# EasyEDA Pro project ProPrj_esp32s31-mp4_2026-09-21.epro, schematic Schematic1

## Sheets
1 MCU: Assembly Variant: Basic; Board Name: Board1; Create Date: 2026-09-02; Page Name: P1; Project Name: esp32s31-mp4; Schematic Name: Schematic1; Update Date: 2026-09-02; Company: 嘉立创EDA; Page Size: A4; Version: V1.0
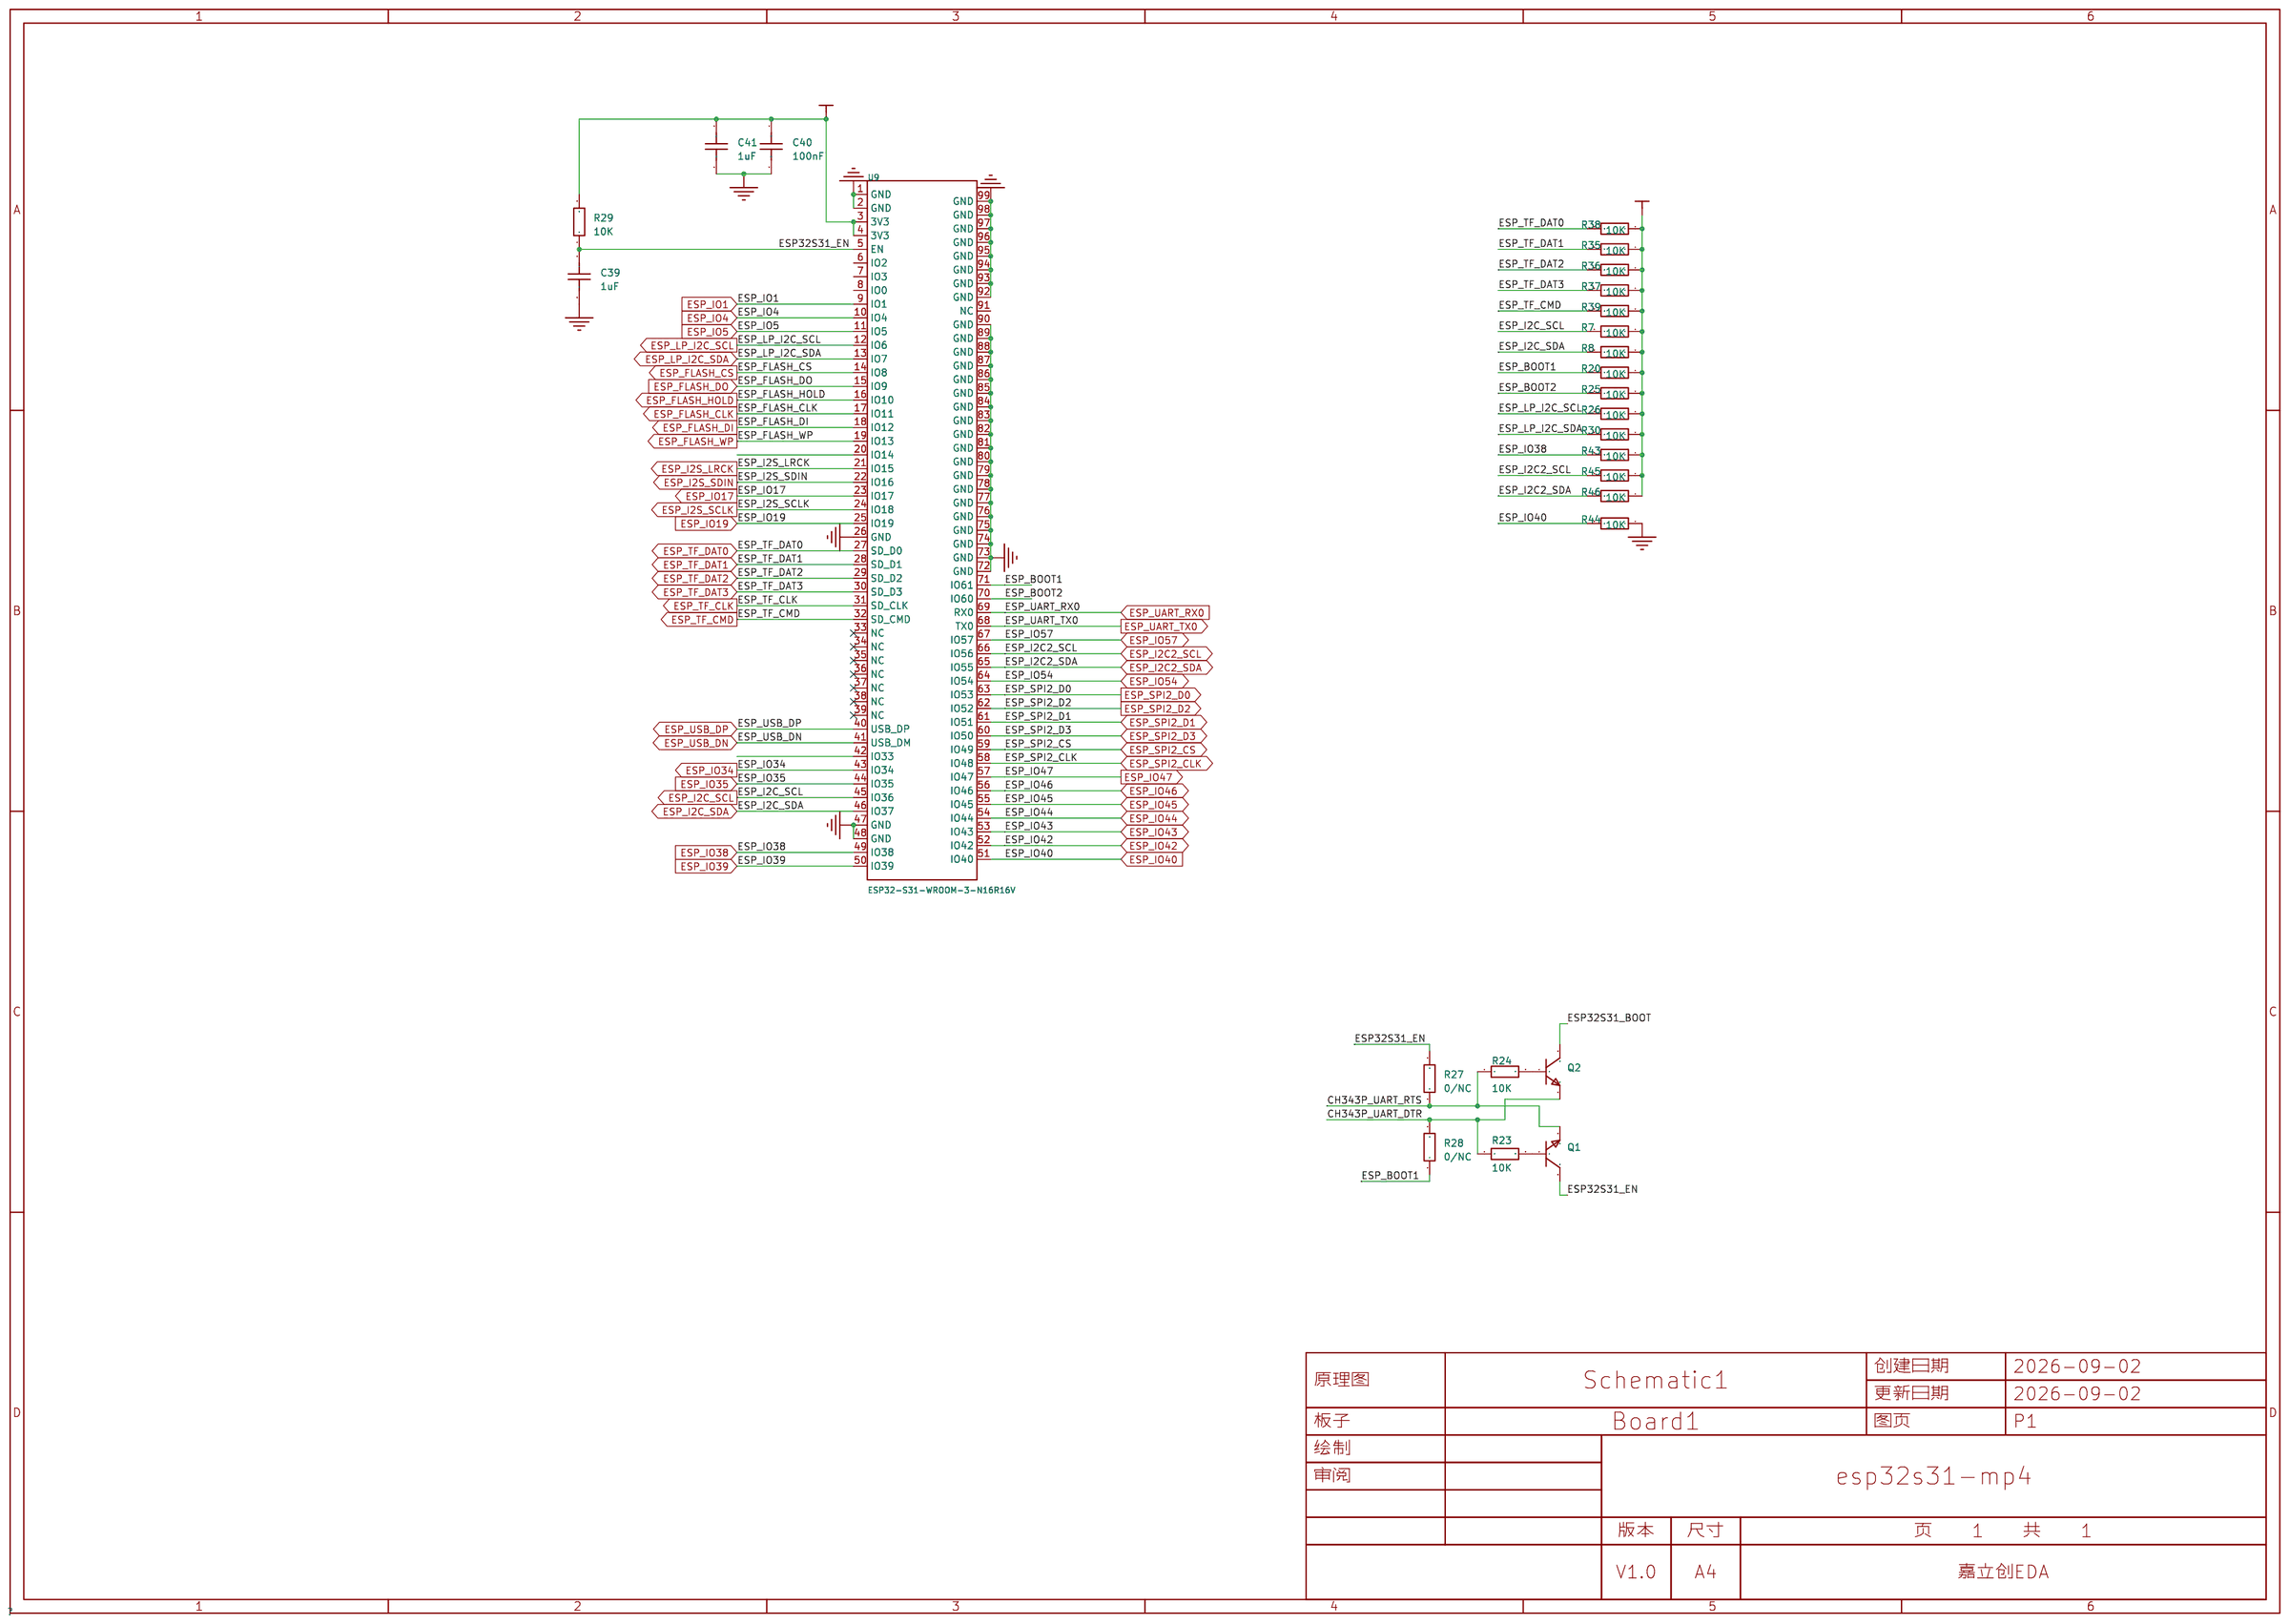
[diagram p0: MCU]
2 POWER: Create Date: 2026-09-14; Page Name: P2; Update Date: 2026-09-14
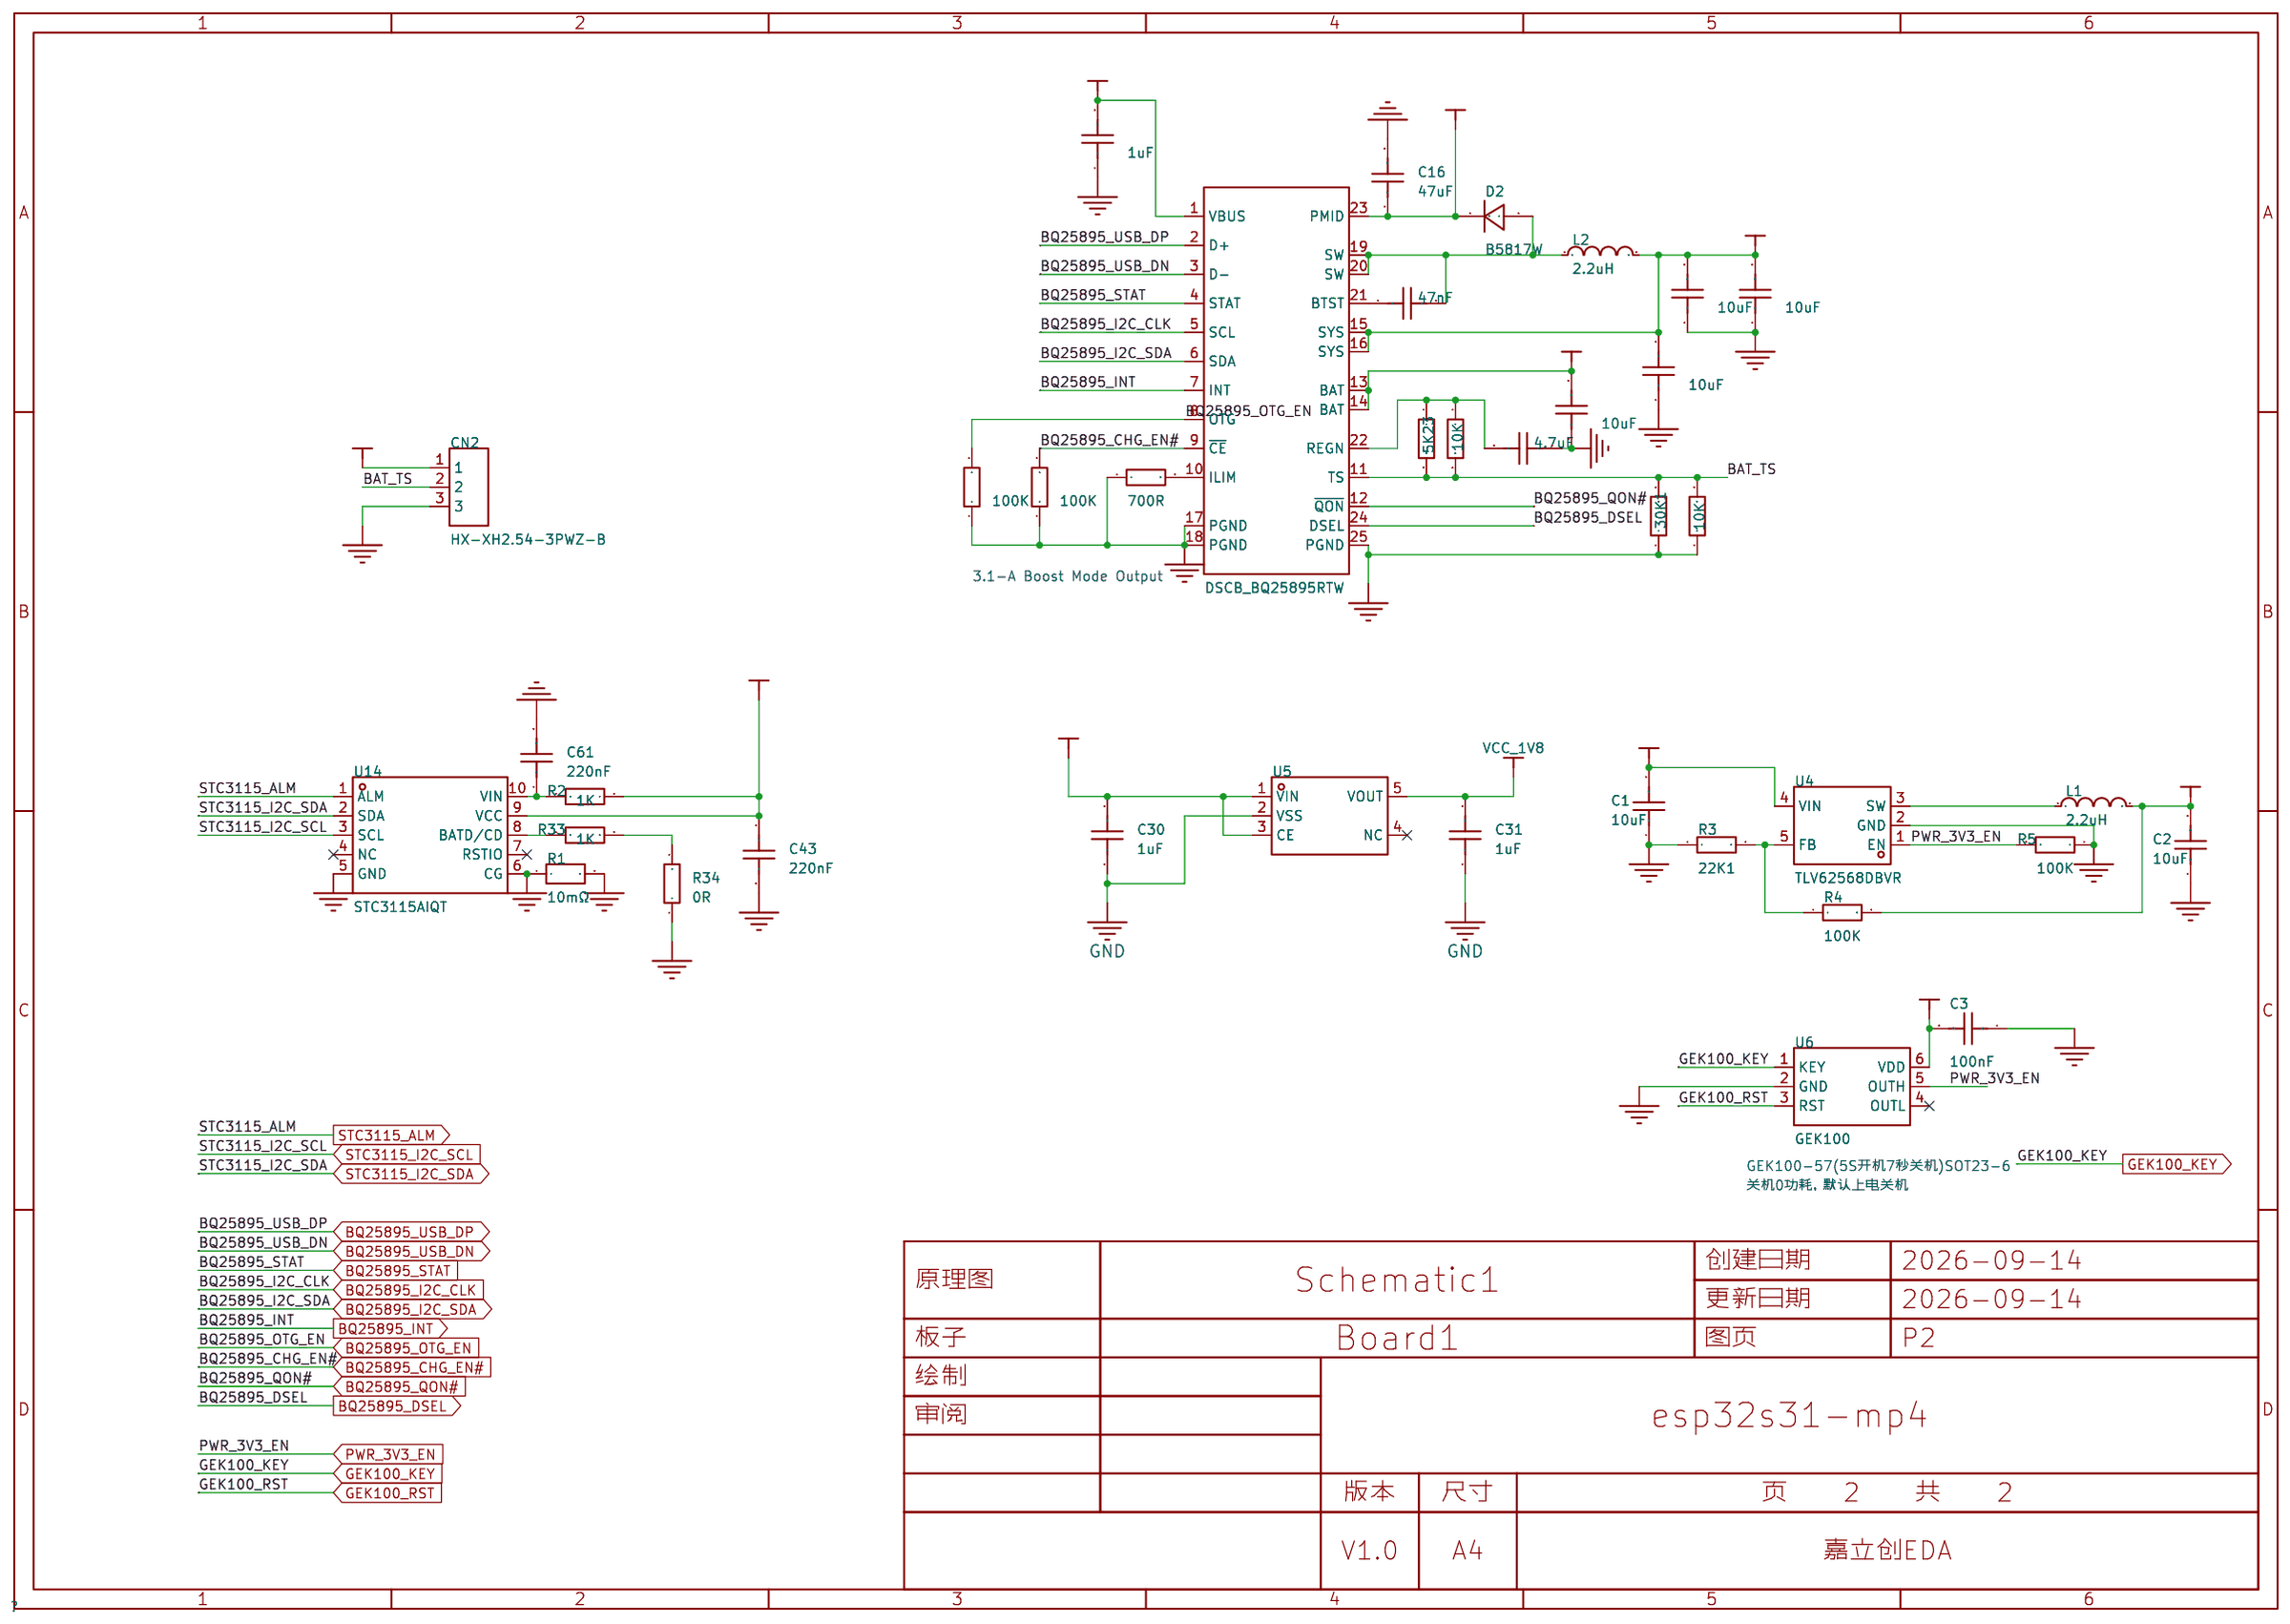
[diagram p1: POWER]
3 DAC: Create Date: 2026-09-14; Update Date: 2026-09-14
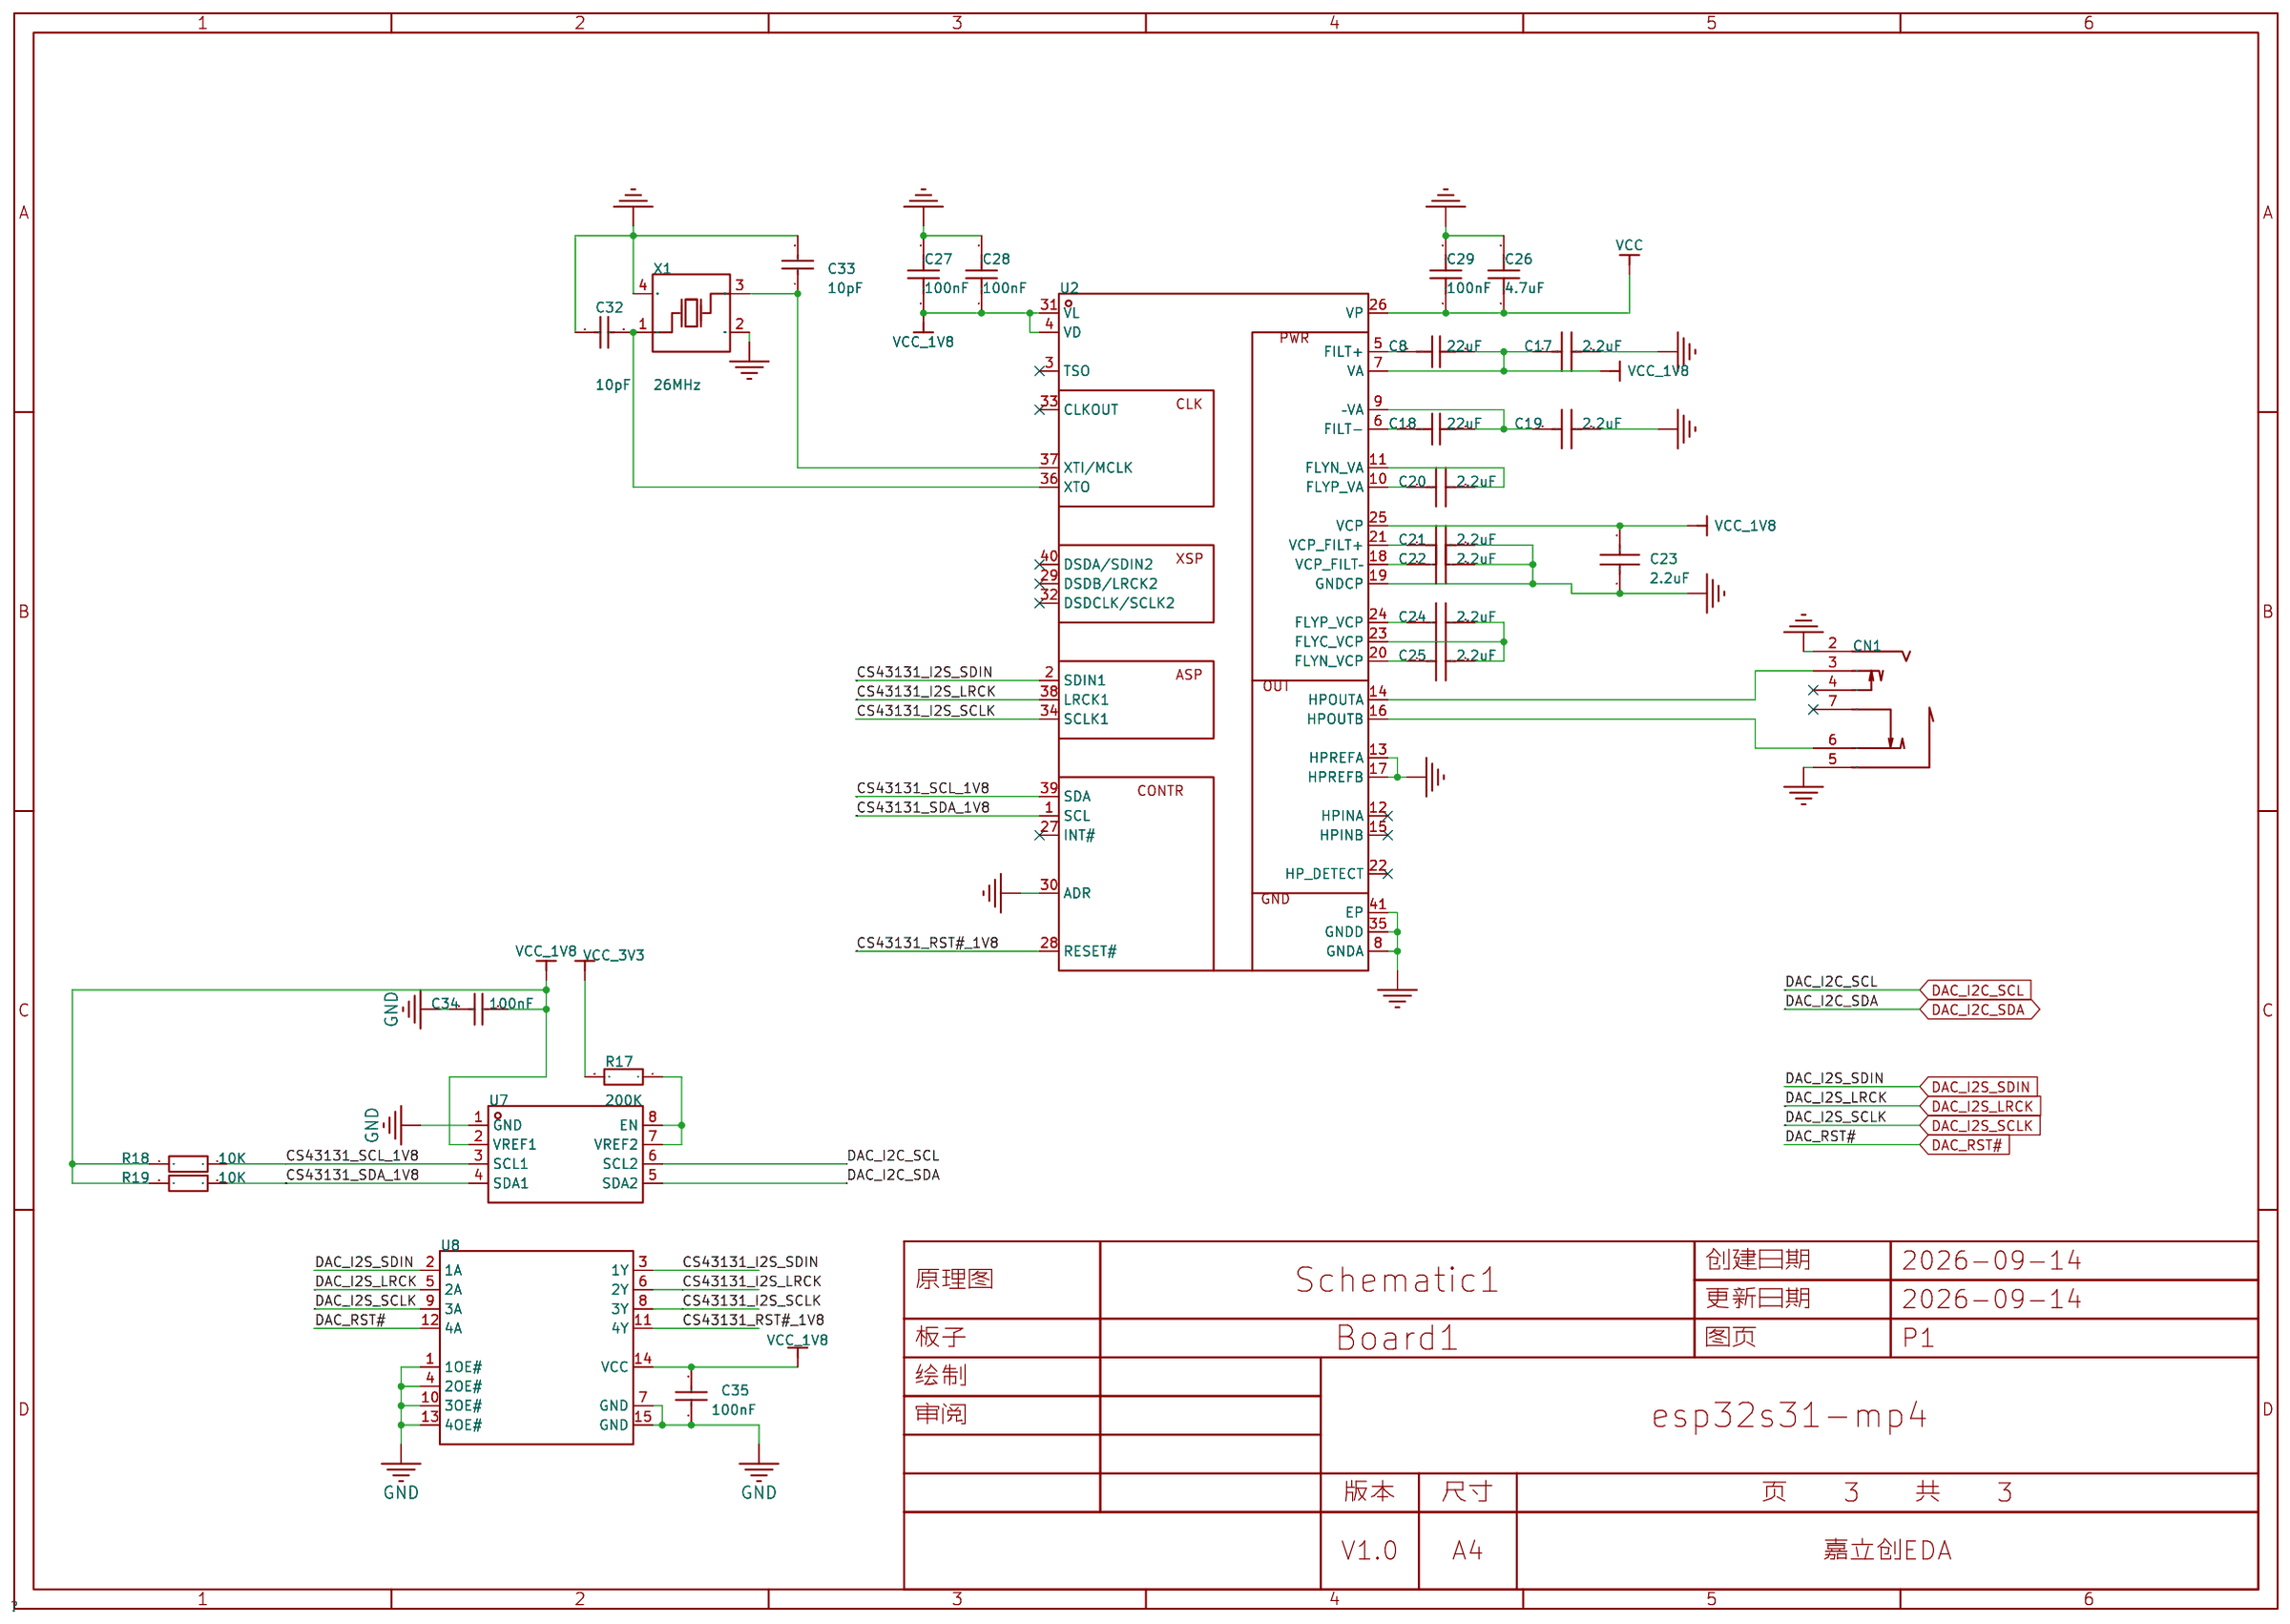
[diagram p2: DAC]
4 DISPLAY: Create Date: 2026-09-14; Update Date: 2026-09-14
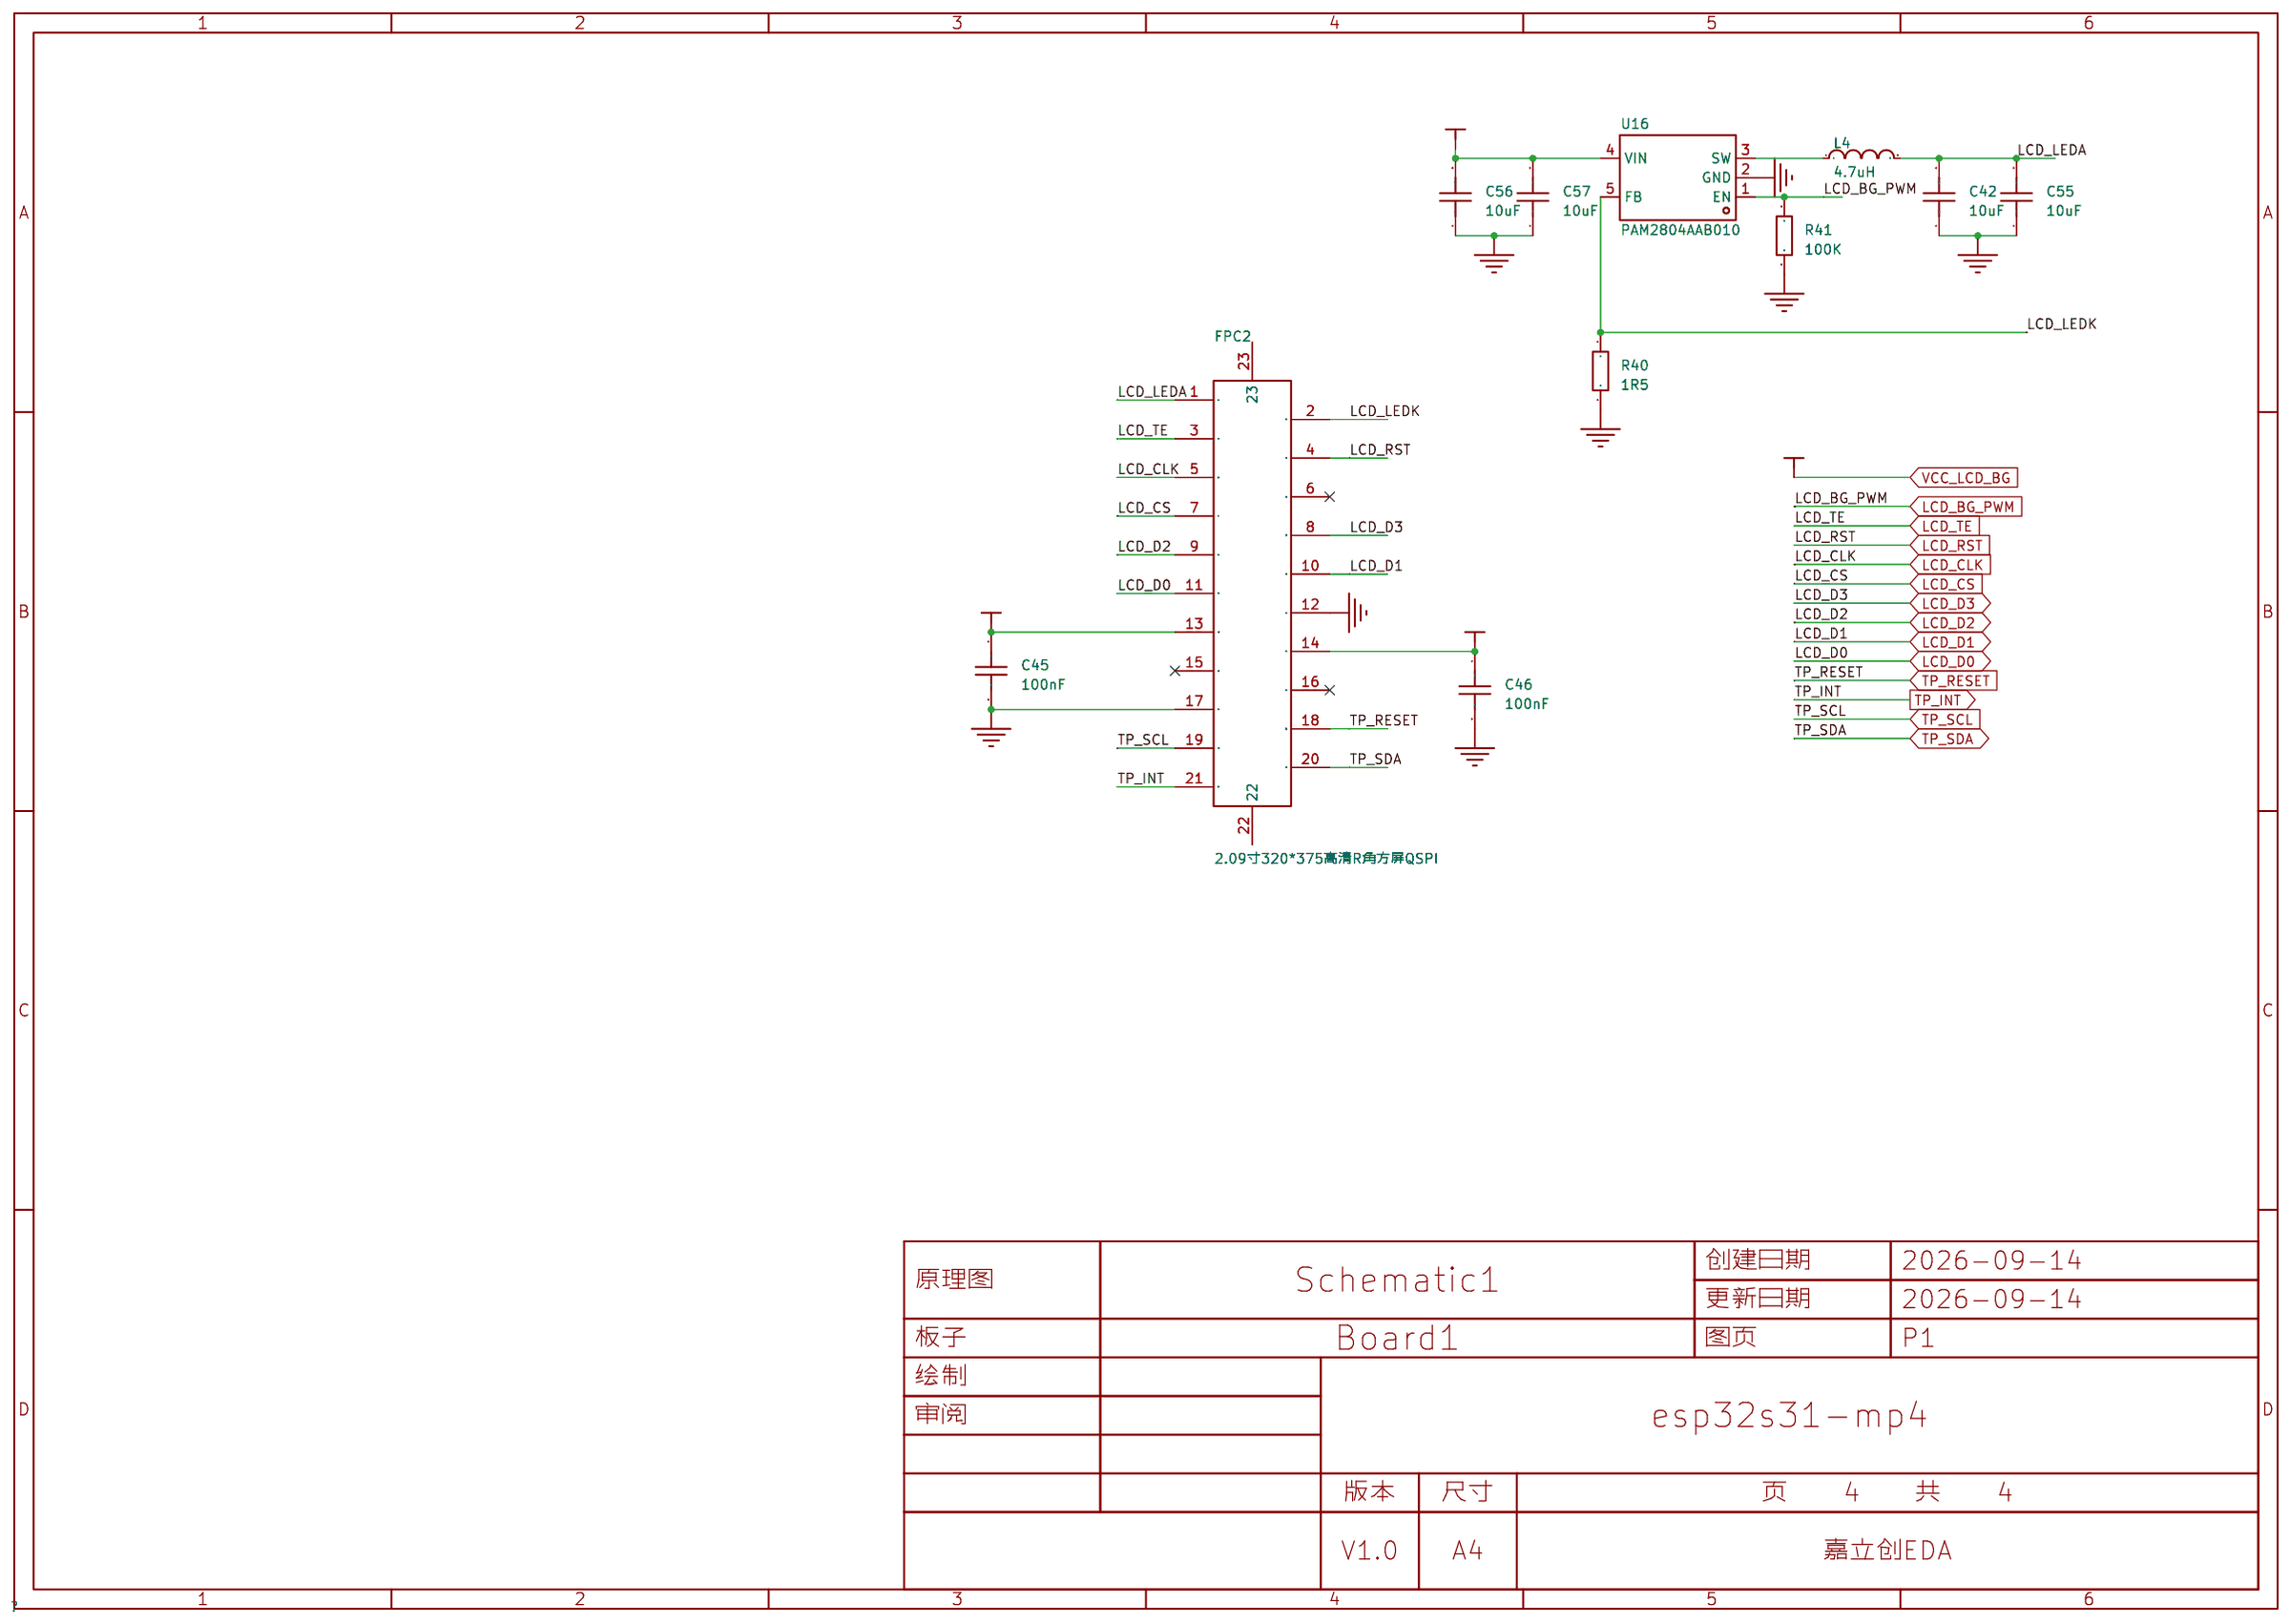
[diagram p3: DISPLAY]
5 MOTOR: Create Date: 2026-09-16; Update Date: 2026-09-16
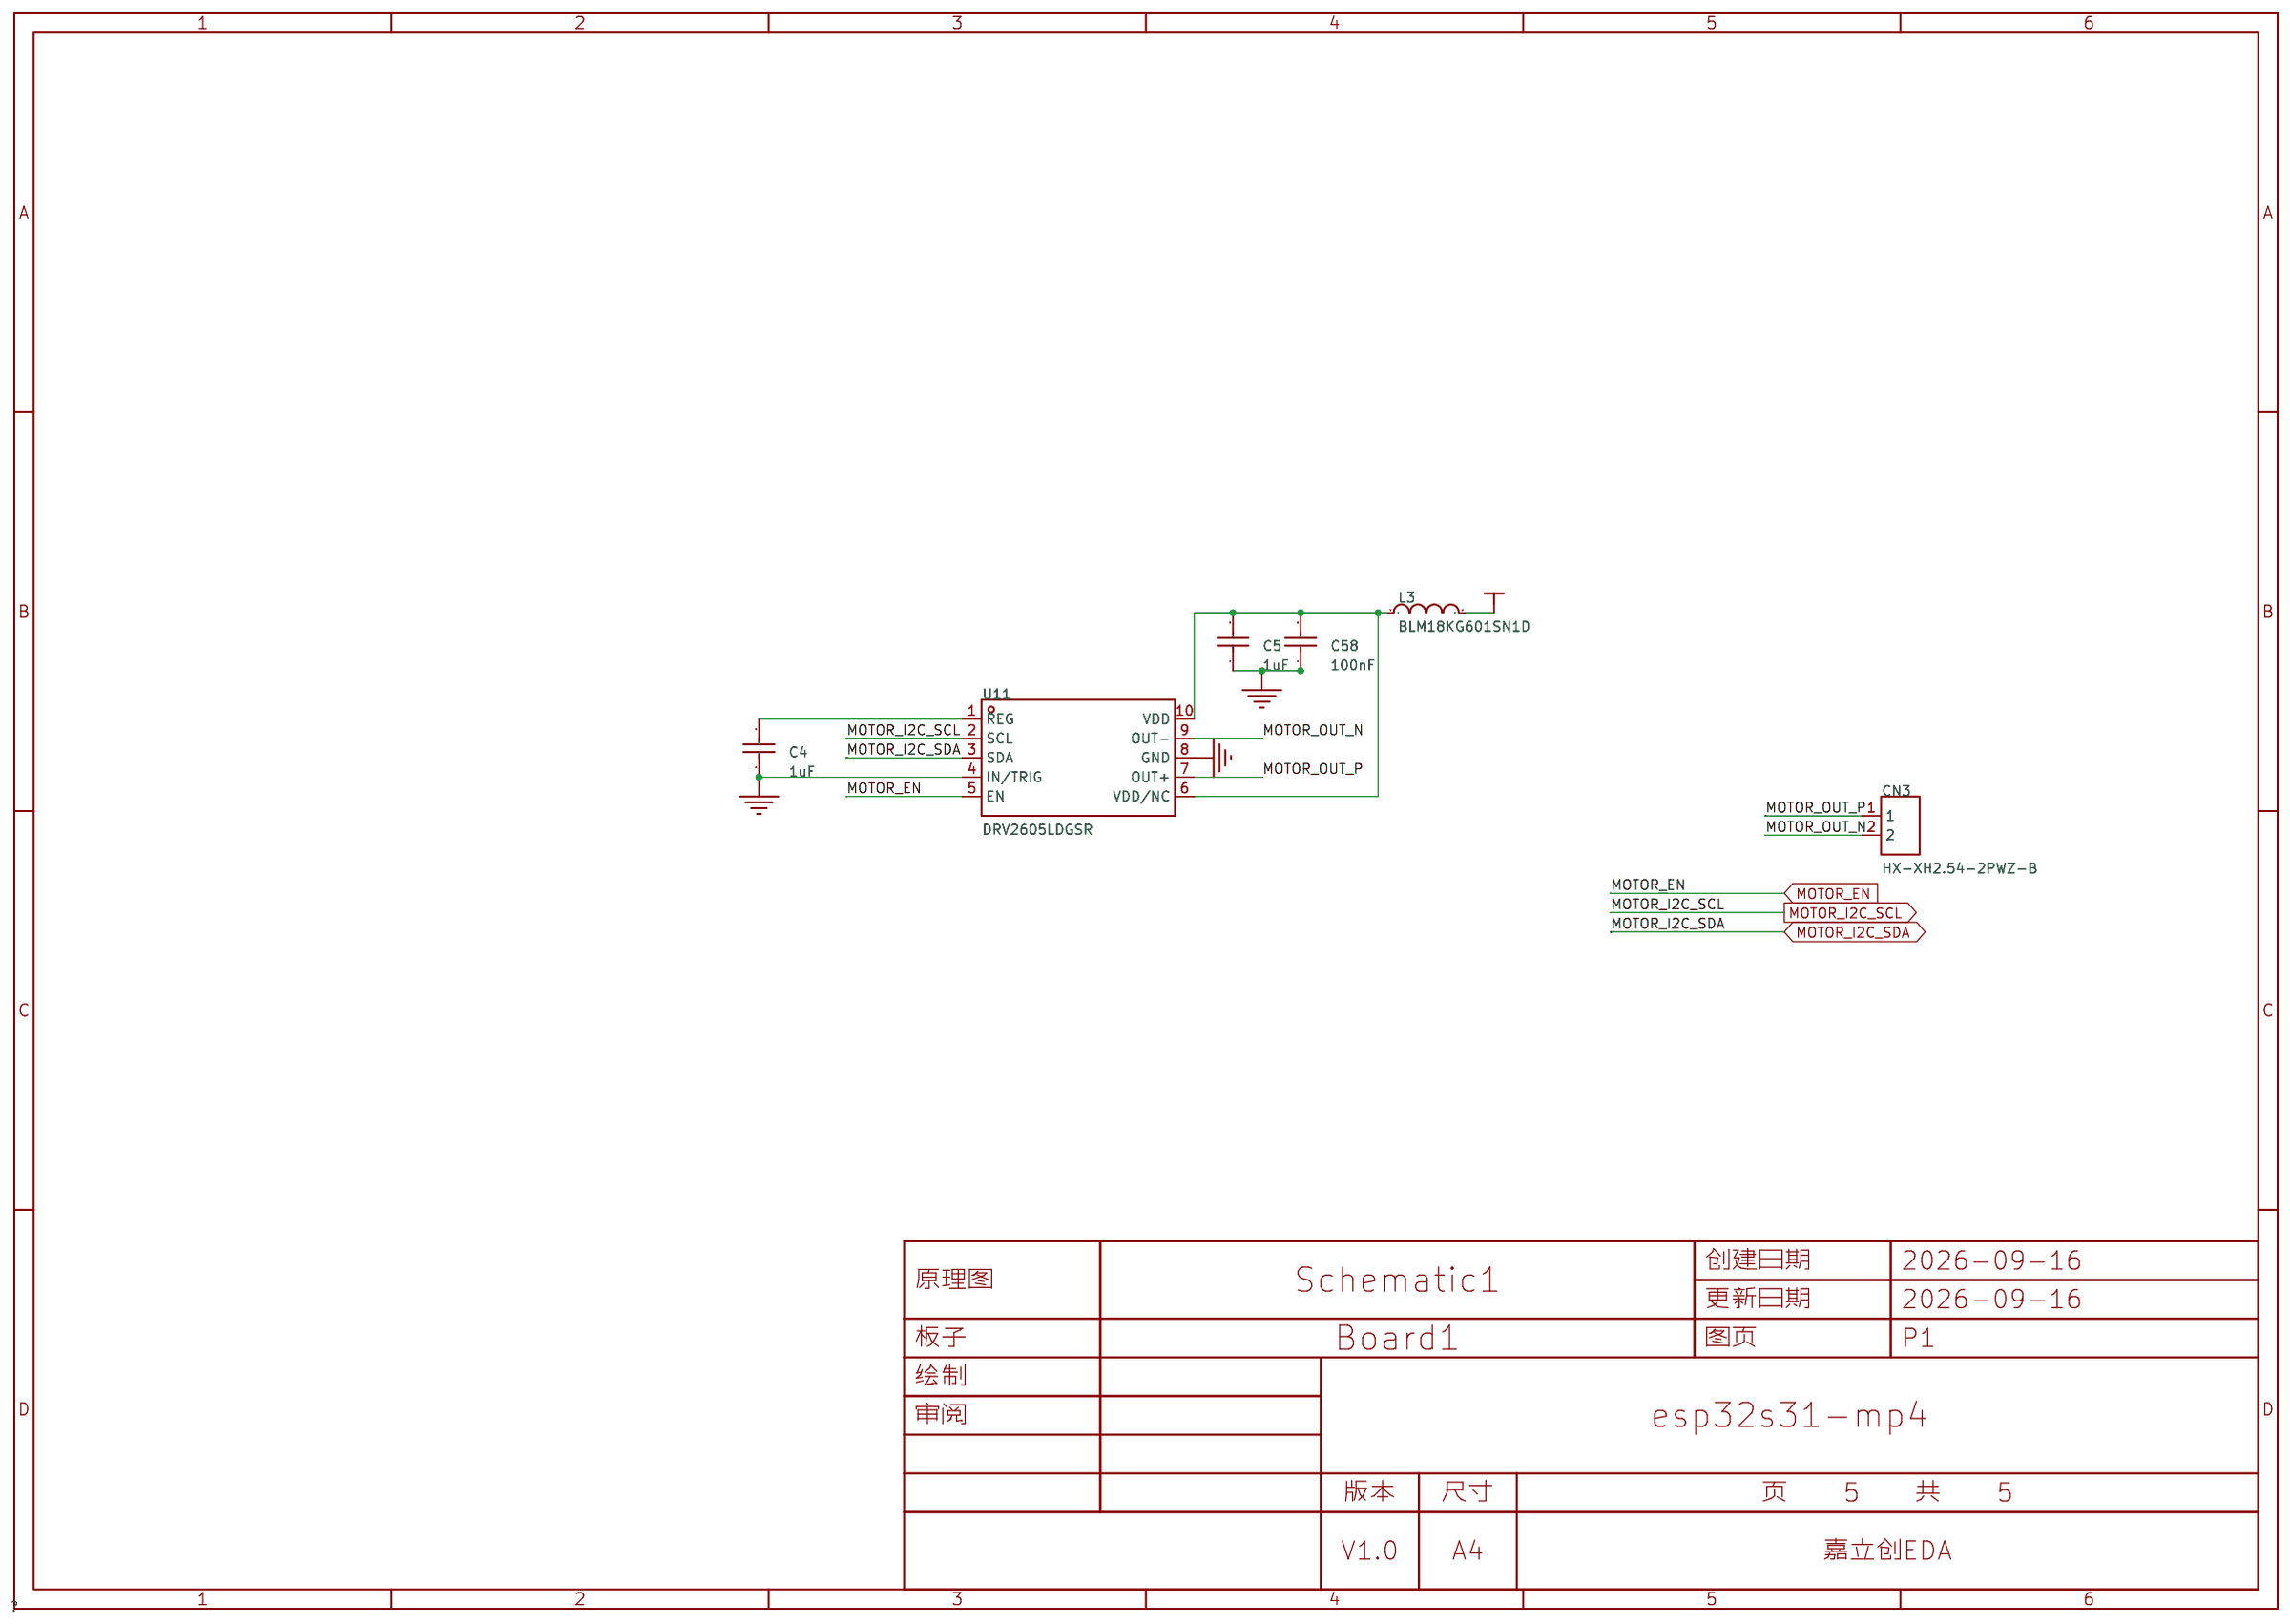
[diagram p4: MOTOR]
6 USB: Create Date: 2026-09-16; Update Date: 2026-09-16
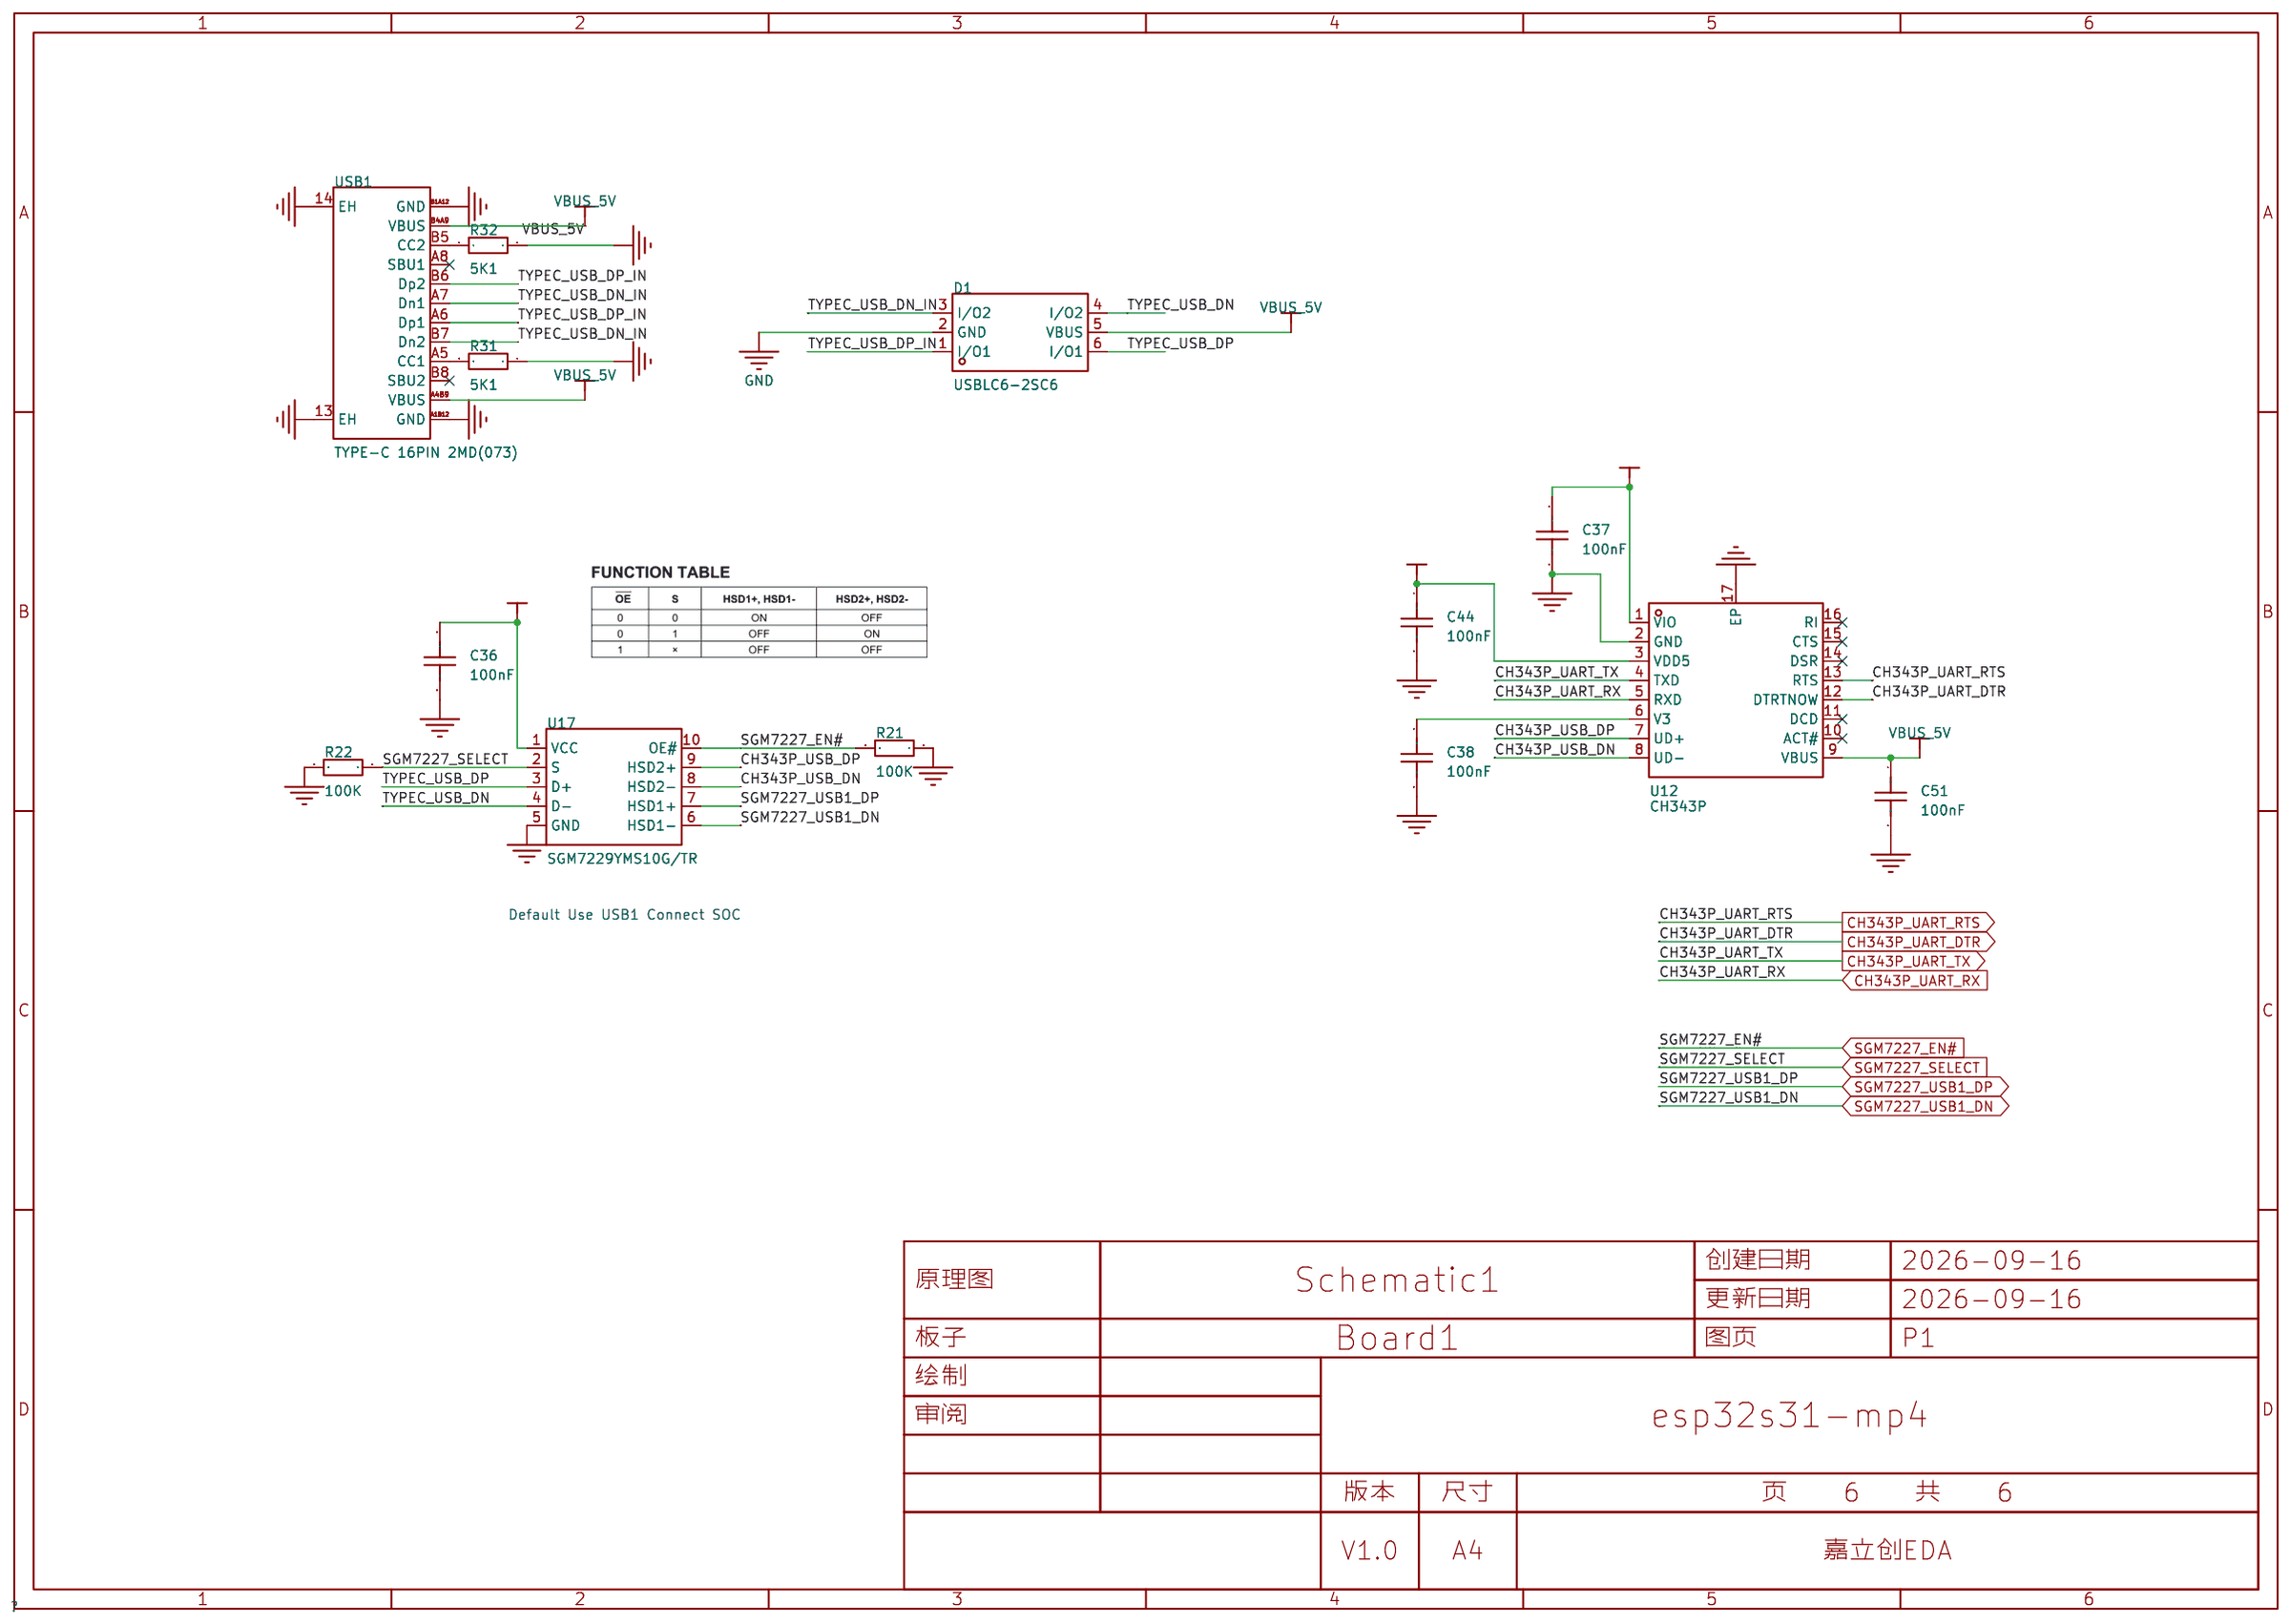
[diagram p5: USB]
7 SENSOR: Create Date: 2026-09-16; Update Date: 2026-09-16
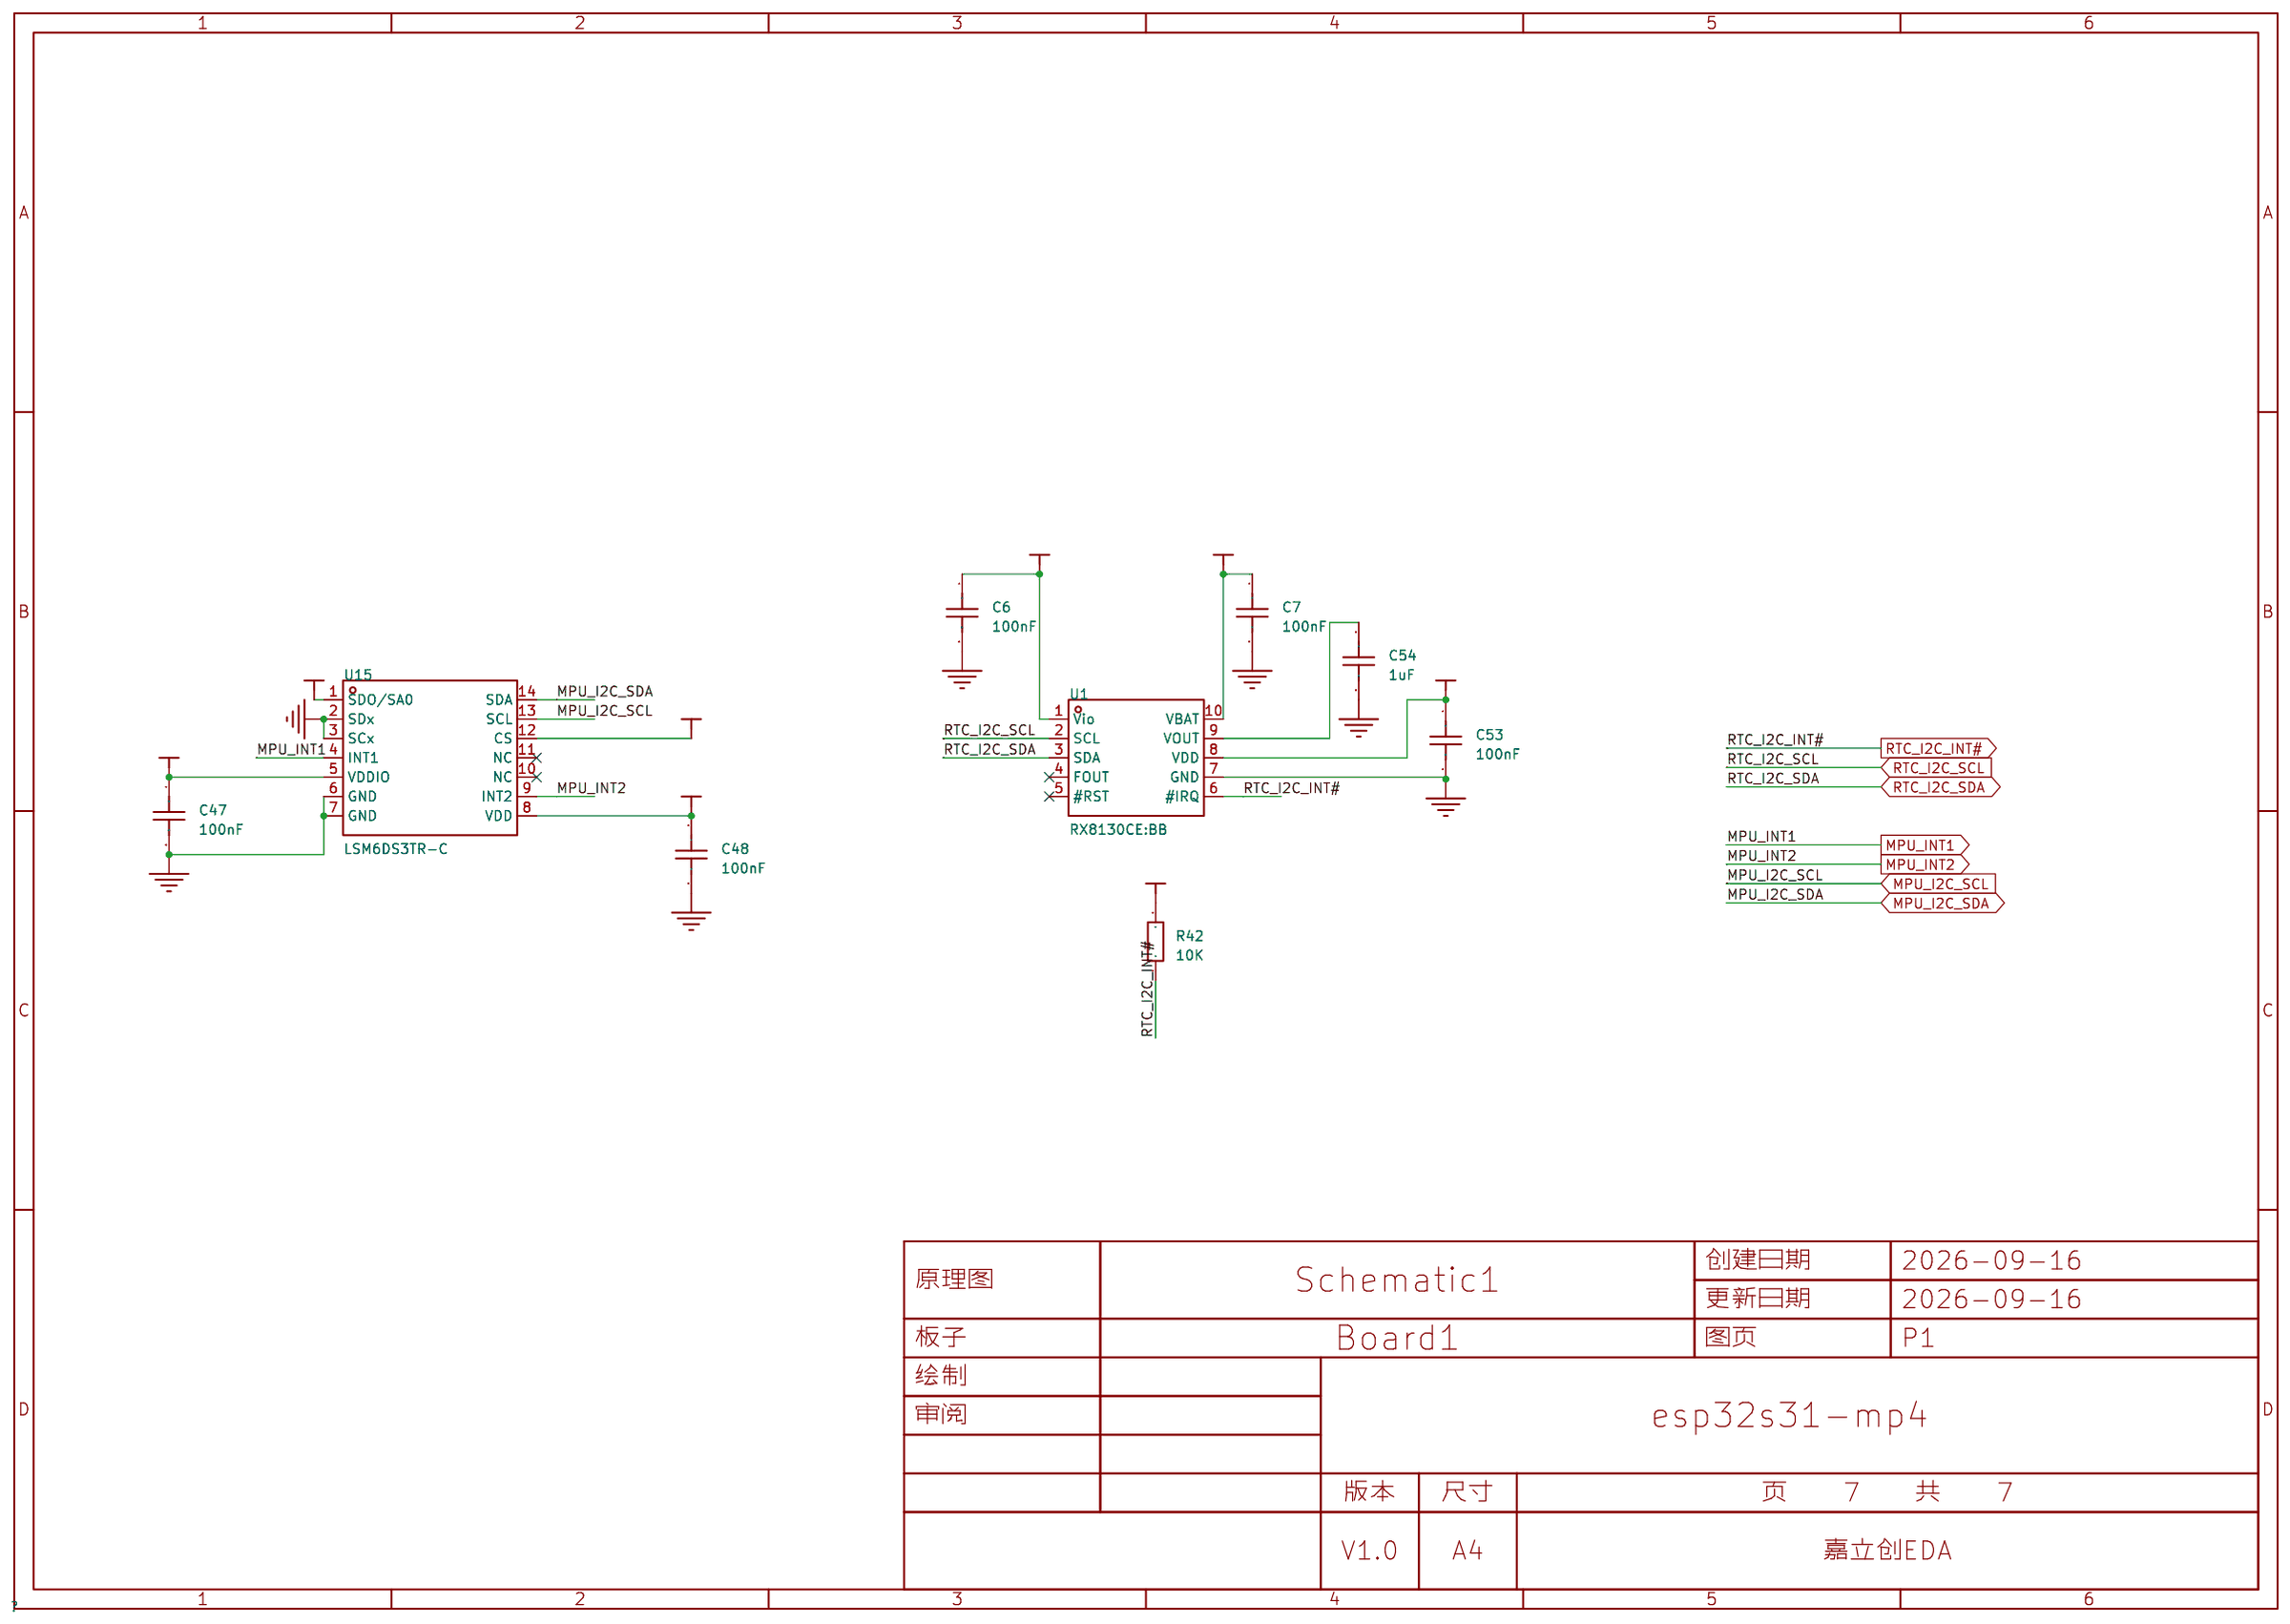
[diagram p6: SENSOR]
8 FLASH/SDCARD: Create Date: 2026-09-16; Update Date: 2026-09-16
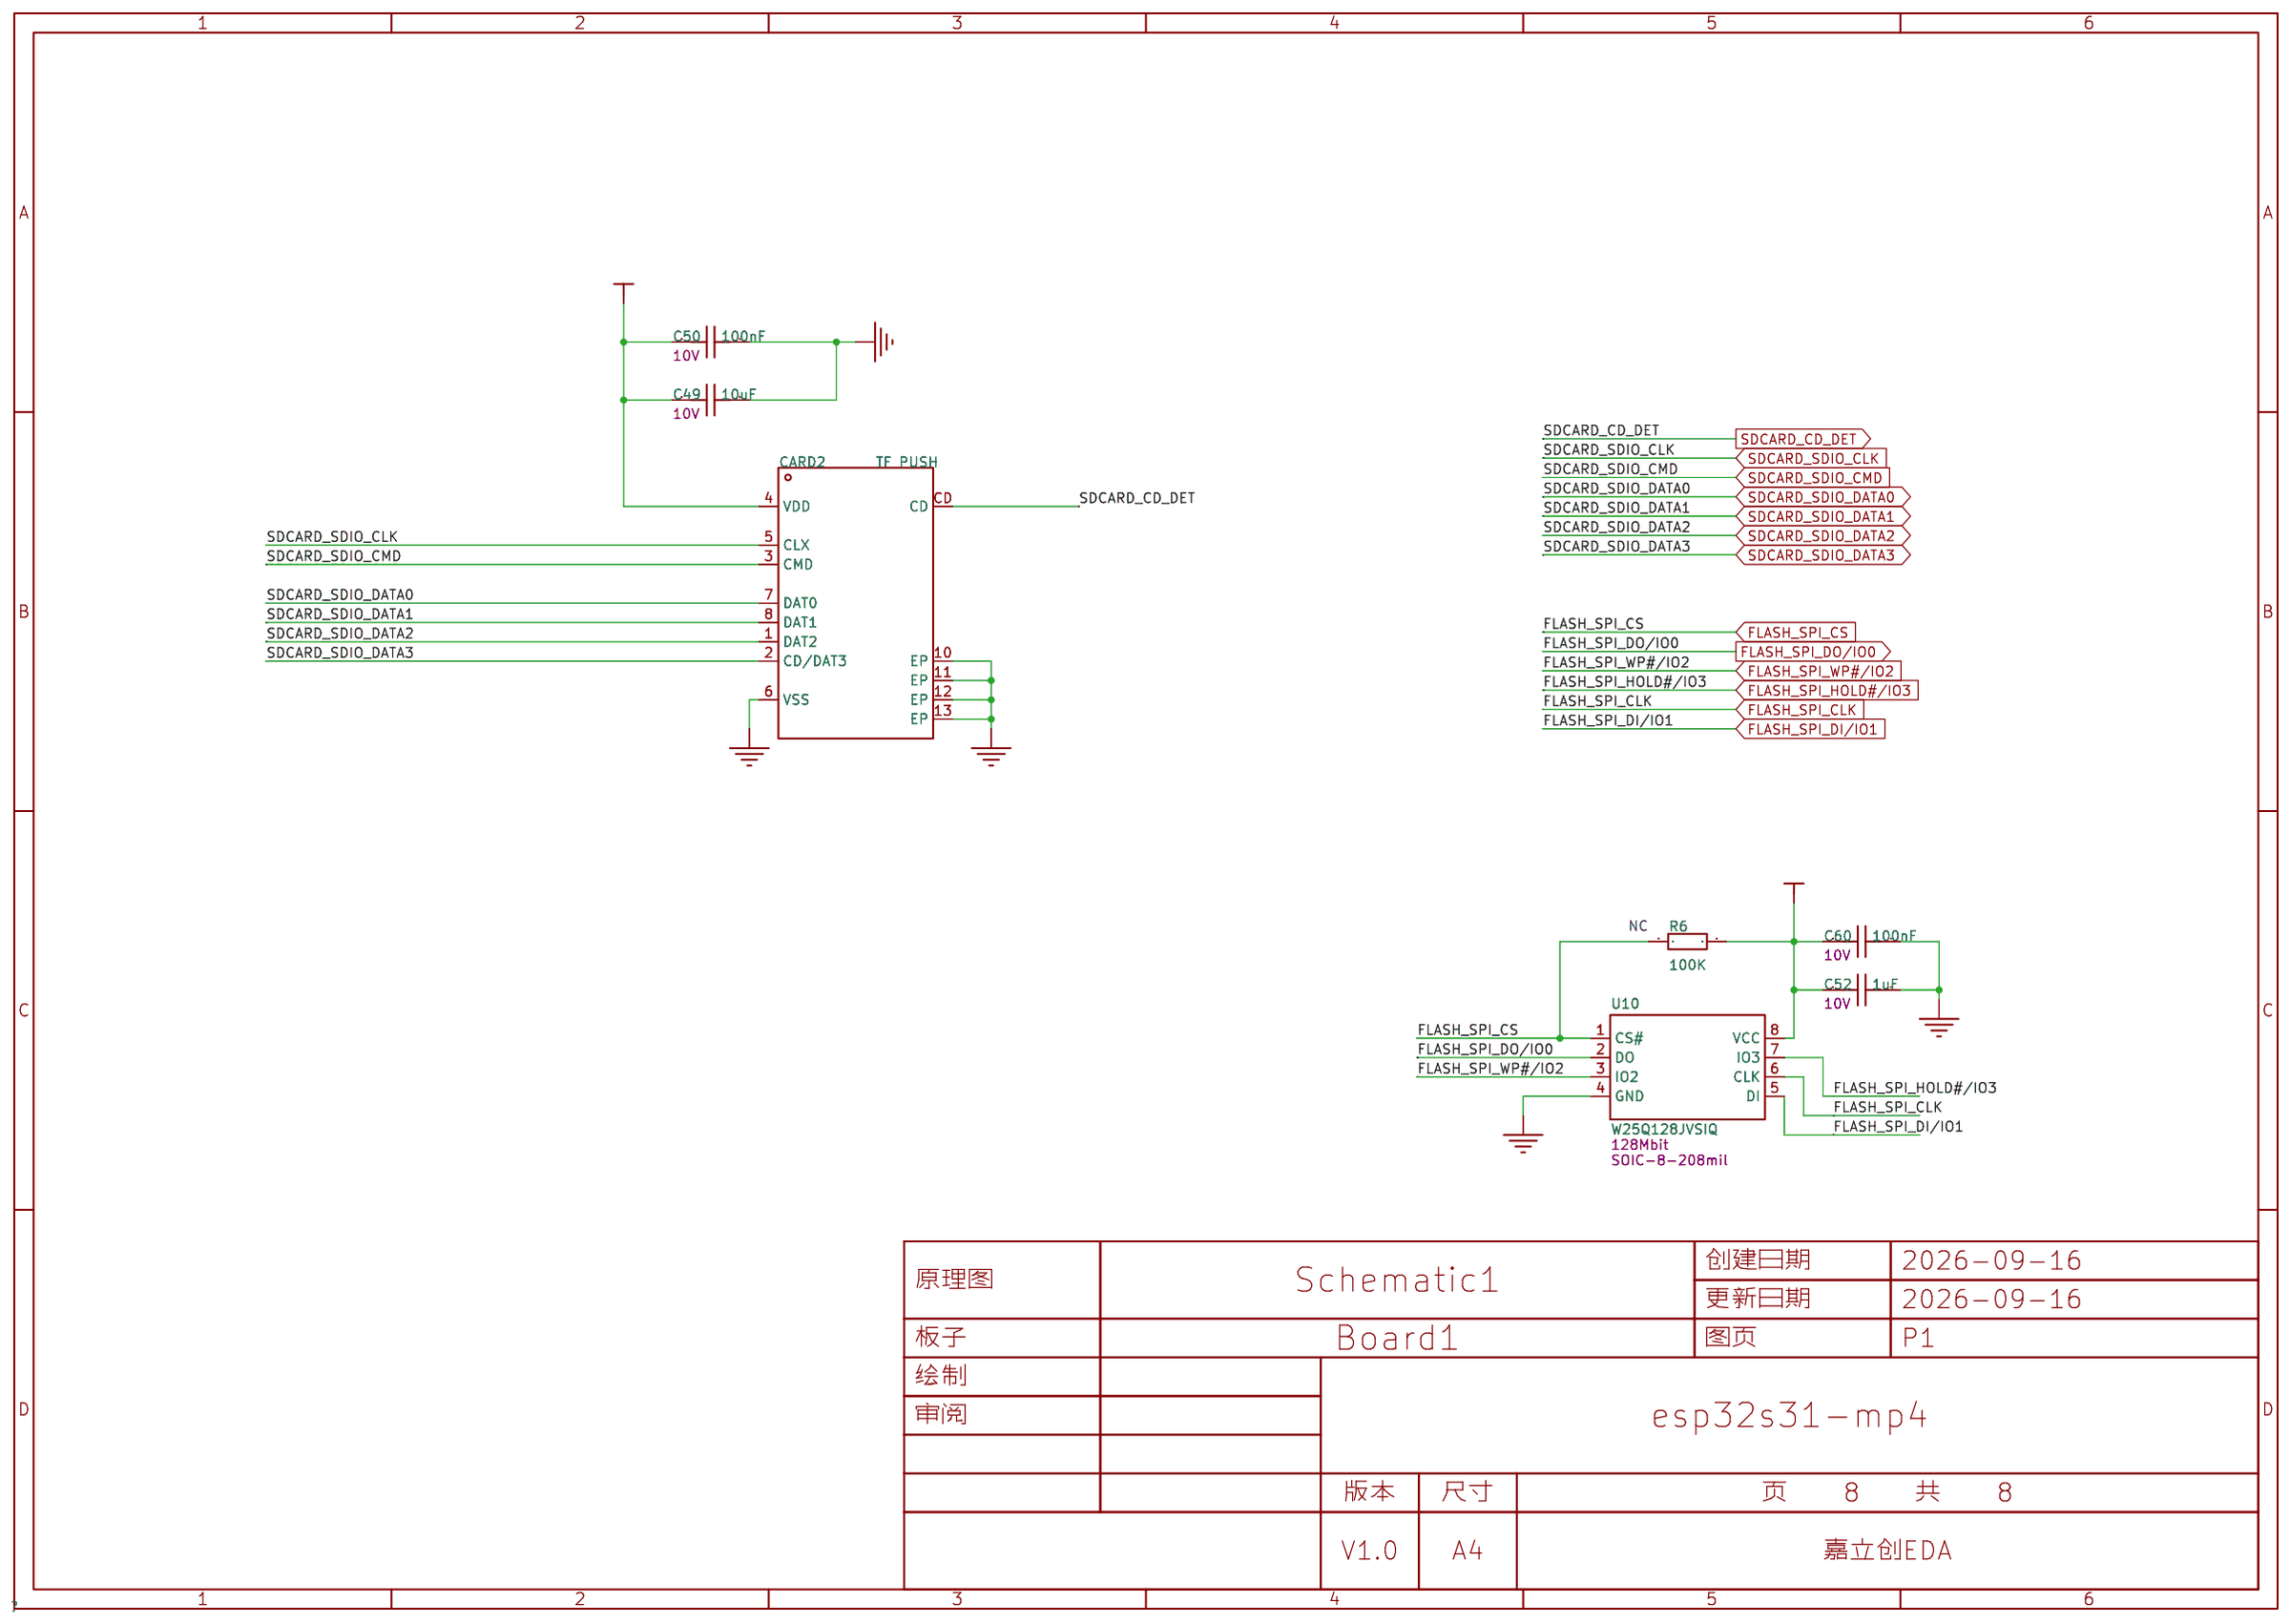
[diagram p7: FLASH/SDCARD]
9 P1: Create Date: 2026-09-16; Update Date: 2026-09-16
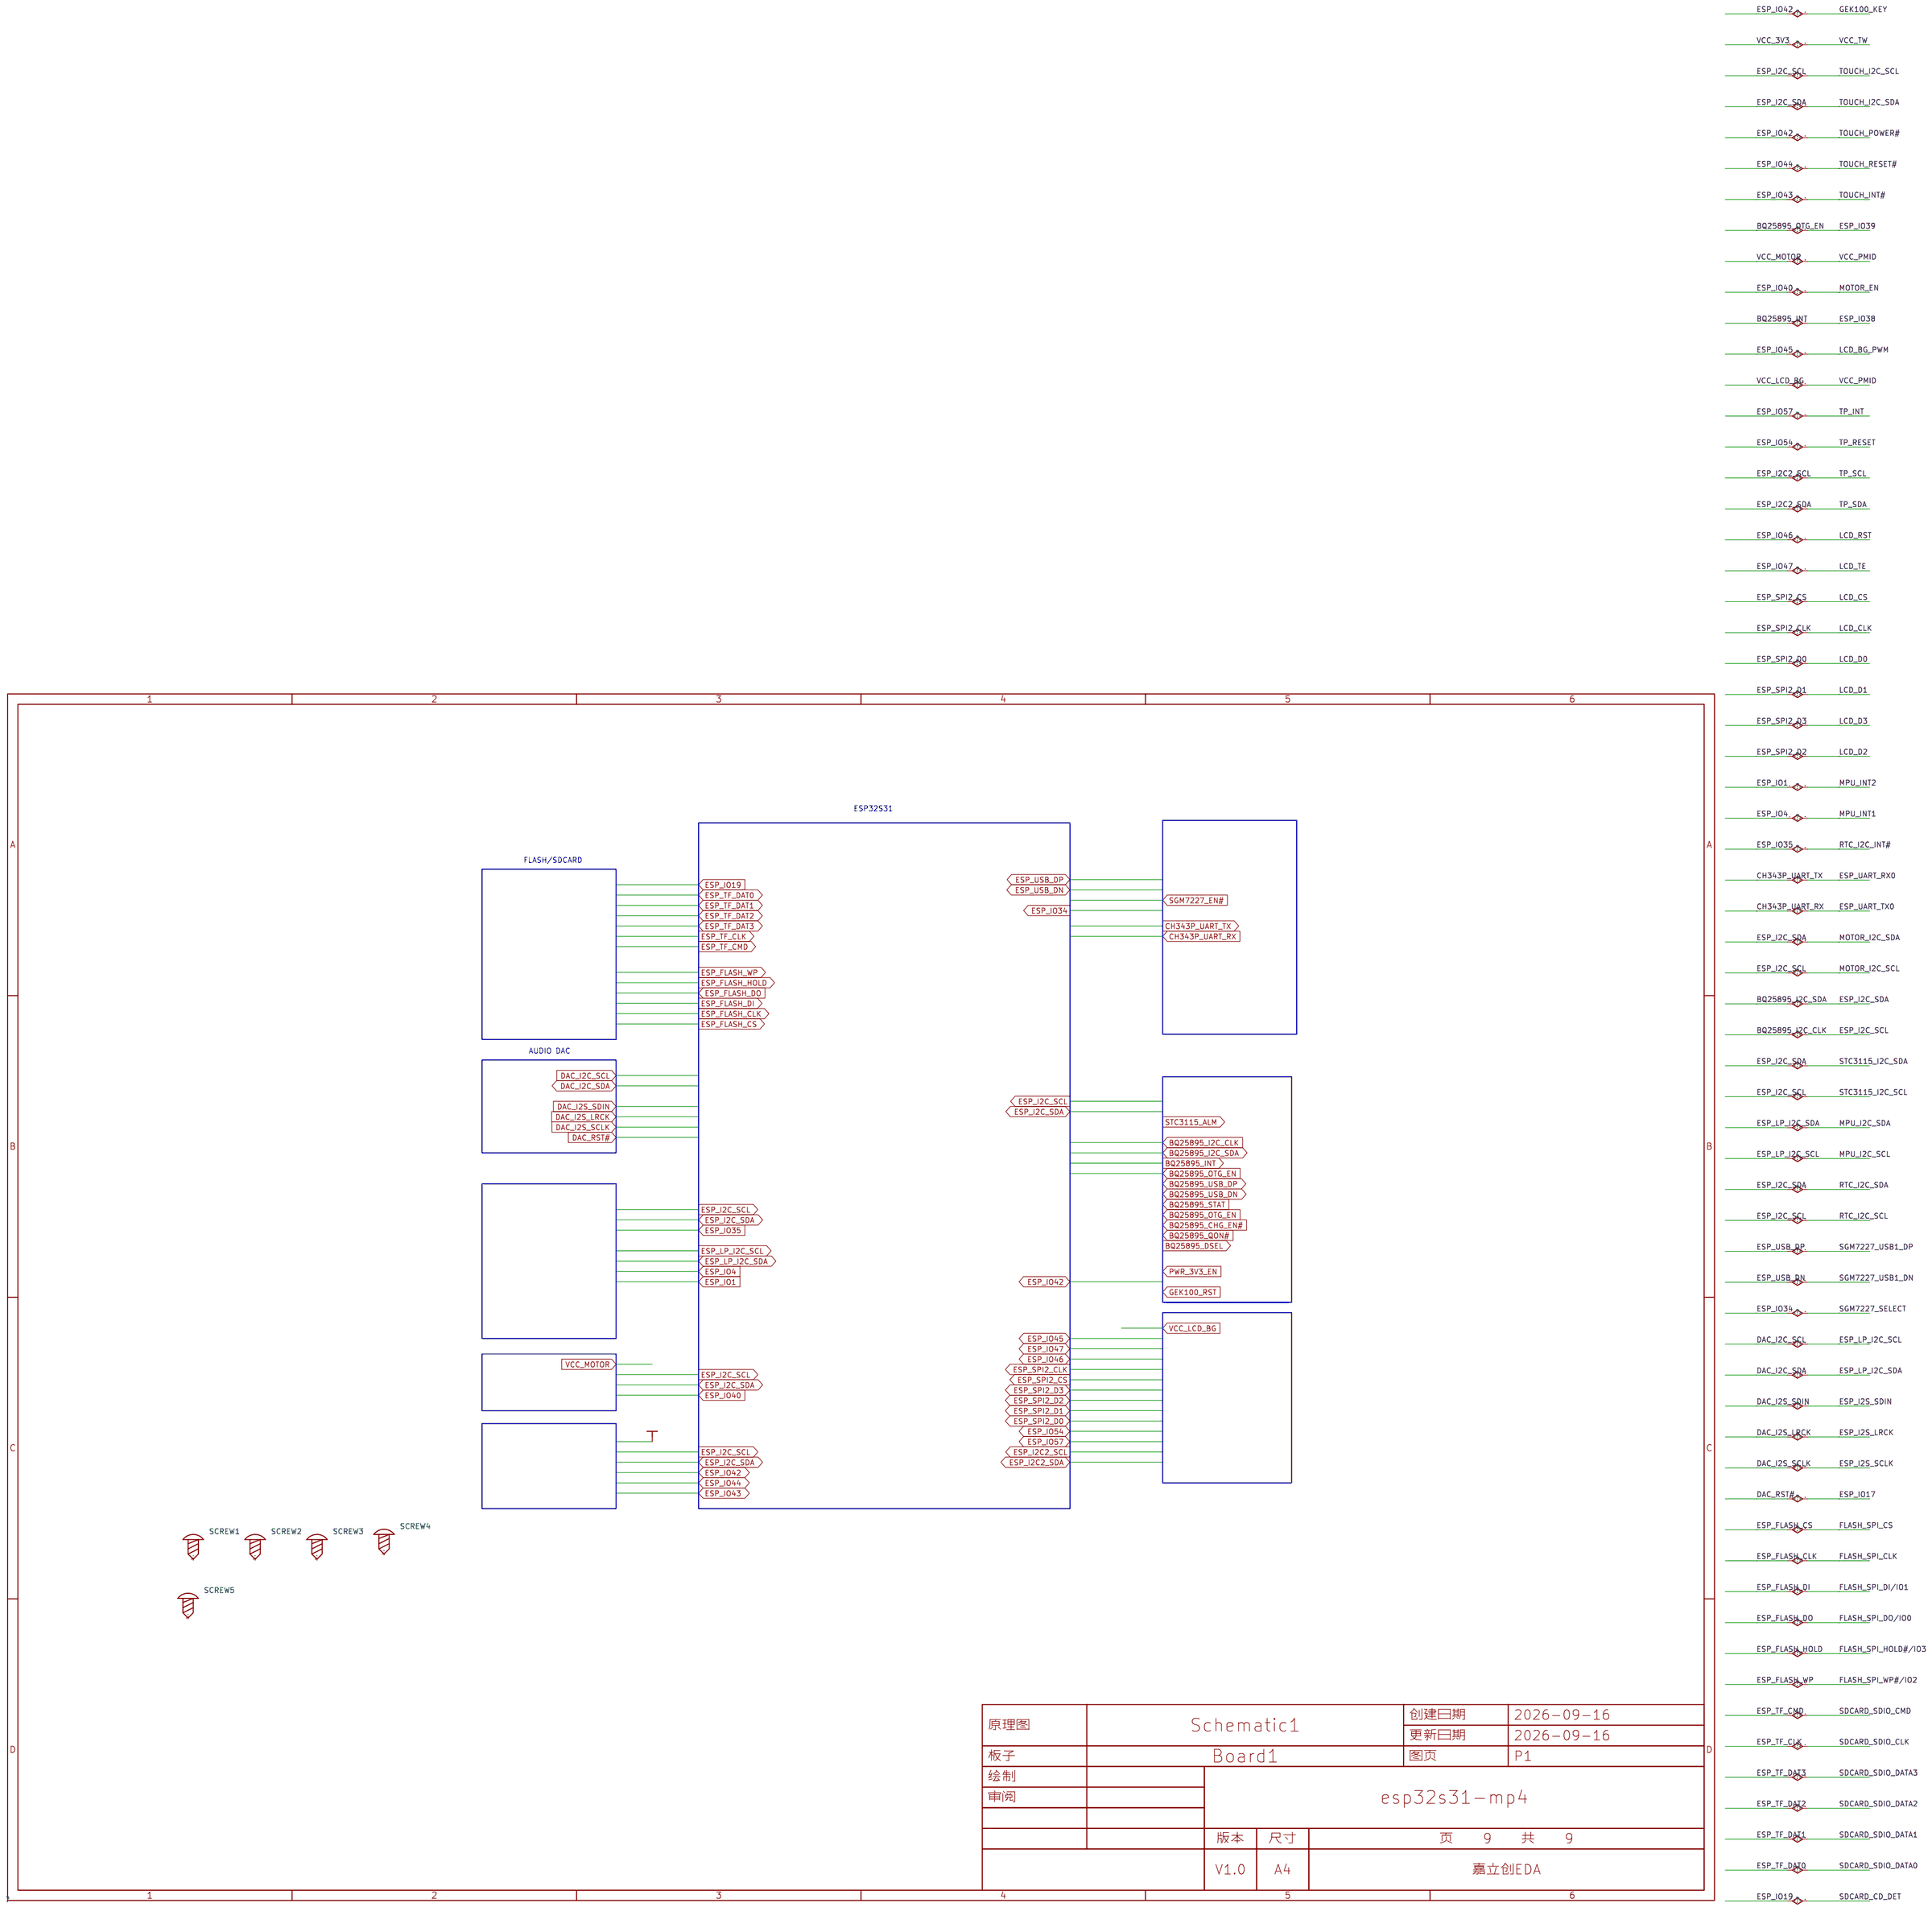
[diagram p8: P1]
10 TOUCH_WHEEL: Create Date: 2026-09-21; Page Name: P2; Update Date: 2026-09-21
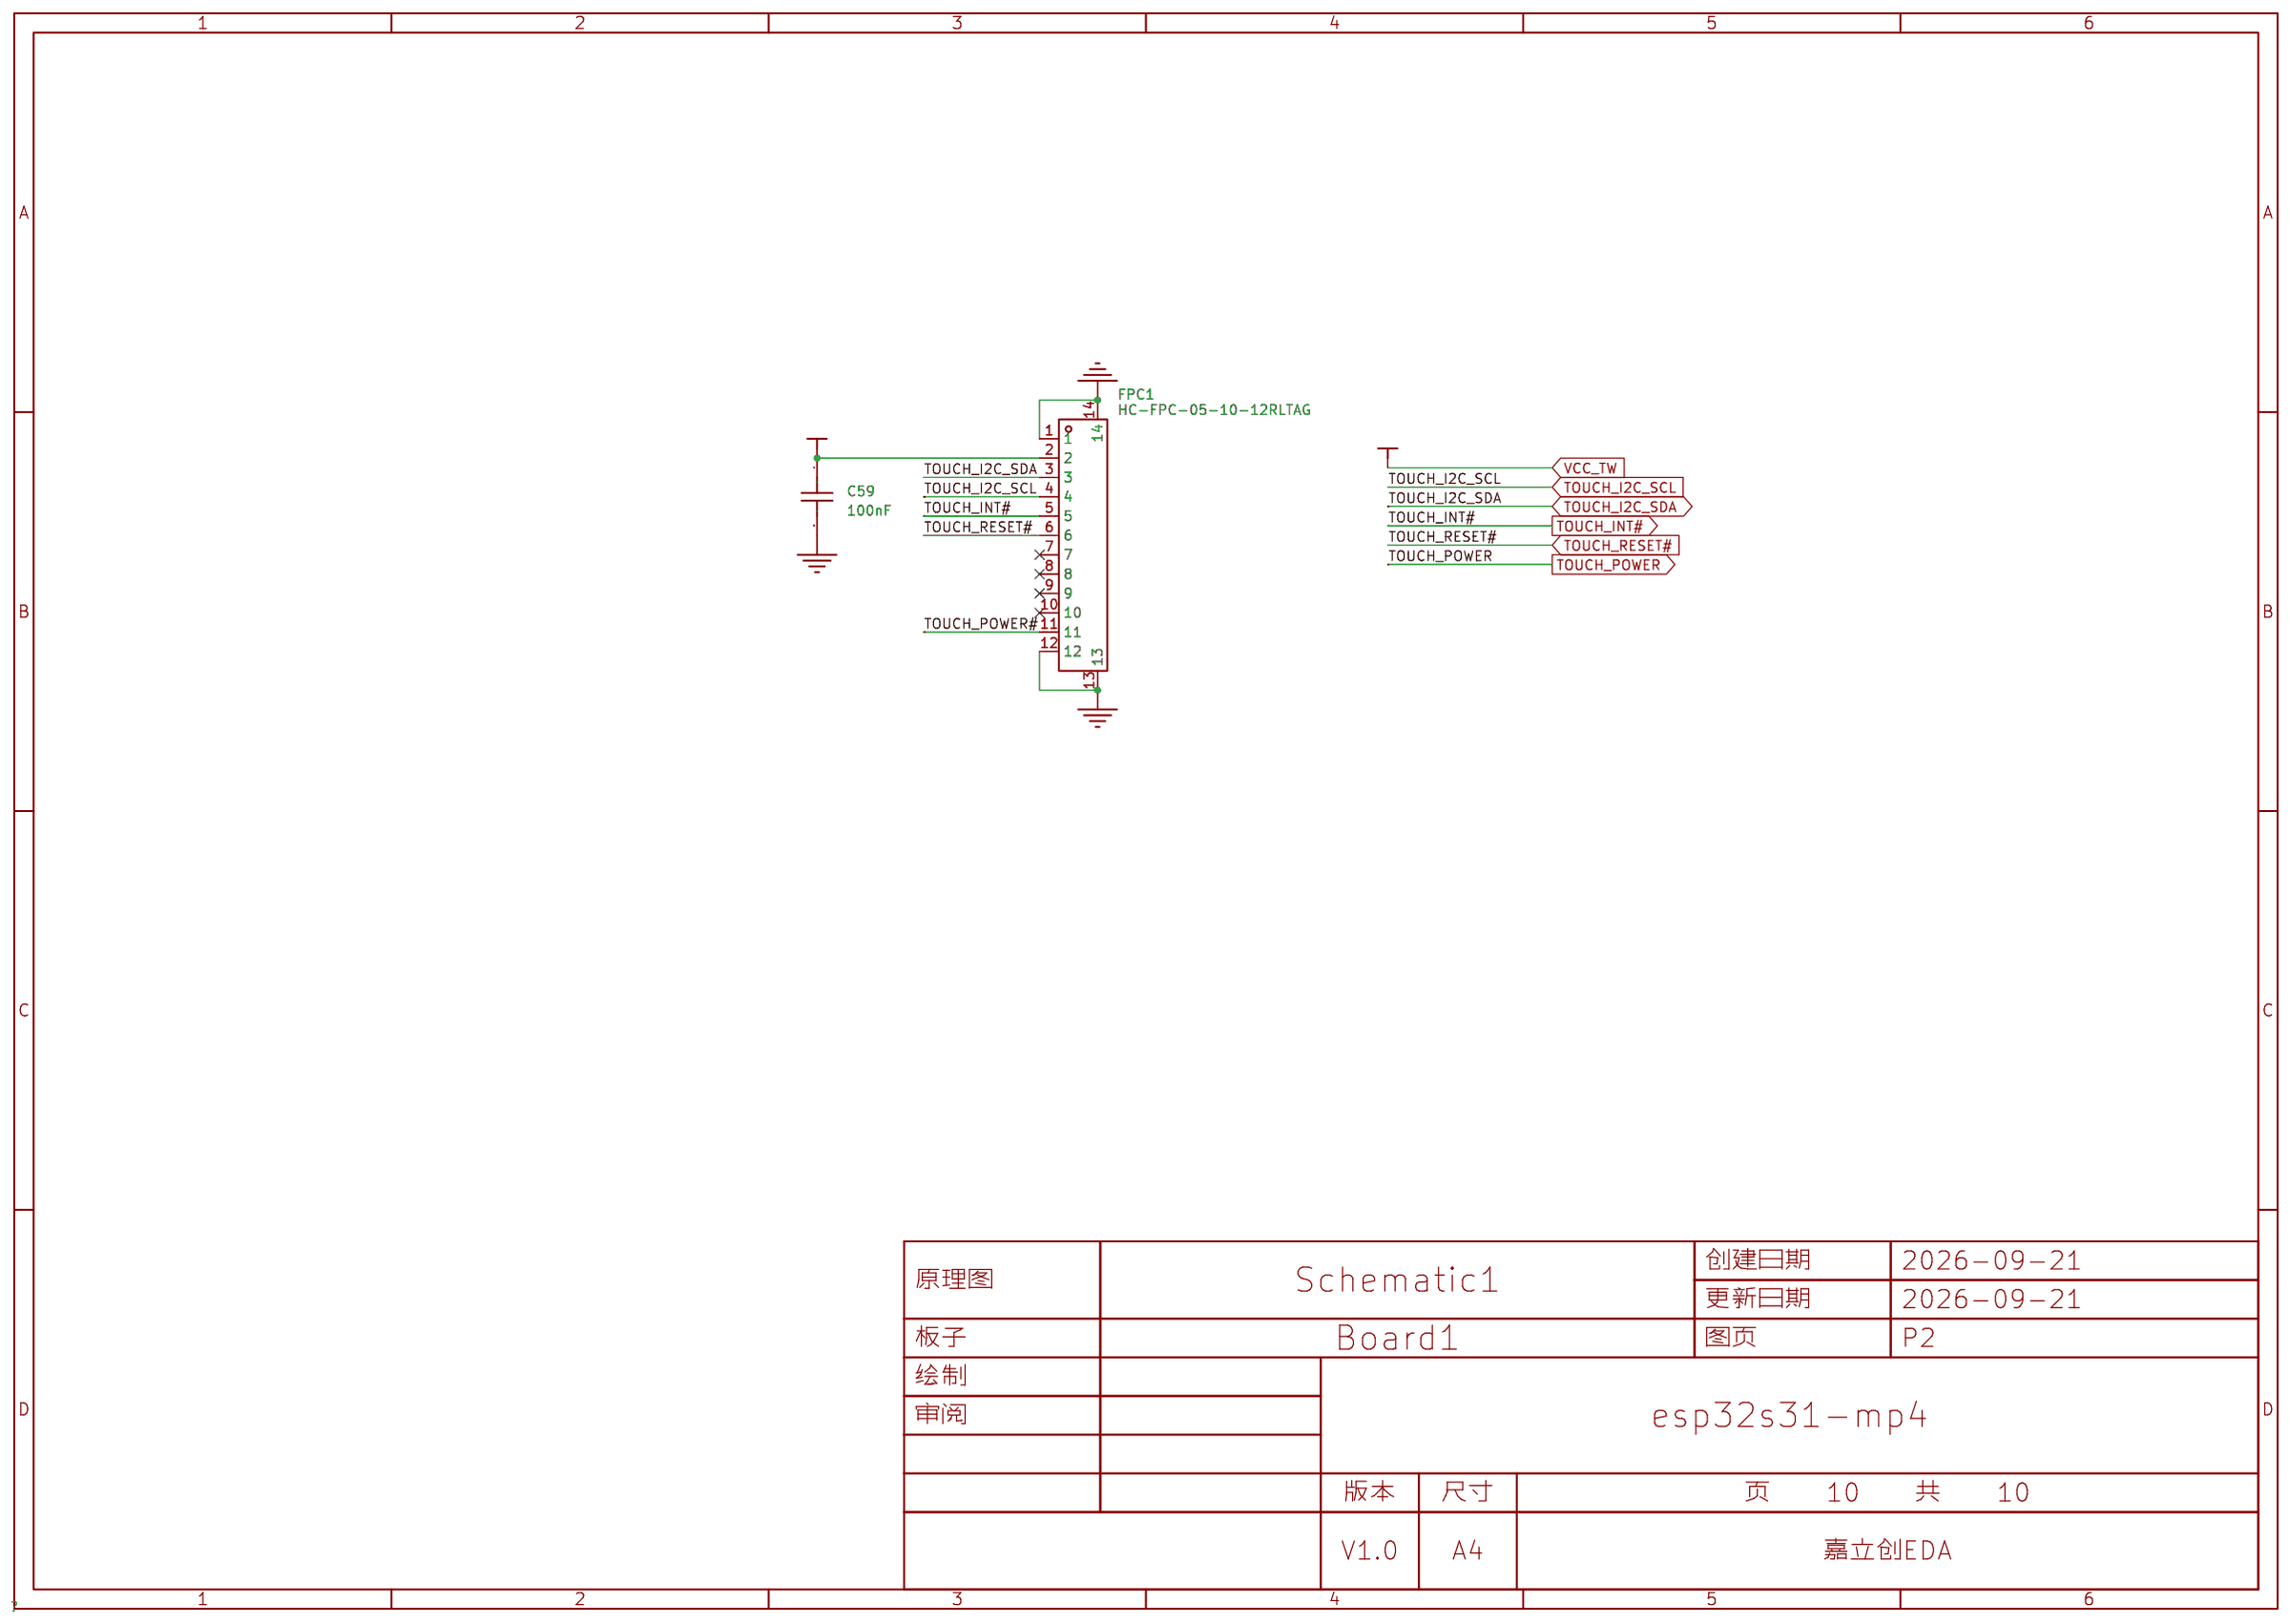
[diagram p9: TOUCH_WHEEL]

## Parts
sheet DAC
C8  22uF  [C0603]
C17  2.2uF  [C0402_1]
C18  22uF  [C0603]
C19  2.2uF  [C0402_1]
C20  2.2uF  [C0402_1]
C21  2.2uF  [C0402_1]
C22  2.2uF  [C0402_1]
C23  2.2uF  [C0402_1]
C24  2.2uF  [C0402_1]
C25  2.2uF  [C0402_1]
C26  4.7uF  [C0402_1]
C27  100nF  [C0402_1]
C28  100nF  [C0402_1]
C29  100nF  [C0402_1]
C32  10pF  [C0402_1]
C33  10pF  [C0402_1]
C34  100nF  [C0402_1]
C35  100nF  [C0402_1]
CN1  PJ-342B-TX-SMT  [AUDIO-SMD_PJ-342B-TX-SMT]
R17  200K  [R0402_2]
R18  10K  [R0402_1]
R19  10K  [R0402_1]
U2  CS43131-CNZ  [QFN-40_L5.0-W5.0-P0.40-TL-EP3.6_1]
U7  PCA9306DQER  [X2SON-8_L1.4-W1.0-P0.35-BL]
U8  SN74LV4T125RGYR  [VQFN-14_L3.5-W3.5-P0.50-BL-EP]
X1  26MHz  [CRYSTAL-SMD_4P-L3.2-W2.5-BL_1]
sheet DISPLAY
C42  10uF  [C0603_1]
C45  100nF  [C0402]
C46  100nF  [C0402]
C55  10uF  [C0603_1]
C56  10uF  [C0603_1]
C57  10uF  [C0603_1]
FPC2  2.09寸320*375高清R角方屏QSPI  [CONN-TH-21P_AFE03-S21FMA-1H]
L4  4.7uH  [IND-SMD_L2.0-W1.6]
R40  1R5  [R1206]
R41  100K  [R0402]
U16  PAM2804AAB010  [SOT-23-5_L3.0-W1.7-P0.95-LS2.8-BR]
sheet FLASH/SDCARD
C49  10uF  [C0402]
C50  100nF  [C0402]
C52  1uF  [C0402]
C60  100nF  [C0402]
CARD2  TF PUSH  [TF-SMD_TF-PUSH]
R6  100K  [R0402]  (no BOM)
U10  W25Q128JVSIQ  [SOIC-8_L5.3-W5.3-P1.27-LS8.0-BL]
sheet MCU
C39  1uF  [C0402]
C40  100nF  [C0402]
C41  1uF  [C0402]
Q1  -  [S8050_SOT-23]  (no BOM)
Q2  -  [S8050_SOT-23]  (no BOM)
R7  10K  [R0402]
R8  10K  [R0402]
R20  10K  [R0402]
R23  10K  [R0402]  (no BOM)
R24  10K  [R0402]  (no BOM)
R25  10K  [R0402]
R26  10K  [R0402]
R27  0/NC  [R0402]
R28  0/NC  [R0402]
R29  10K  [R0402]
R30  10K  [R0402]
R35  10K  [R0402]
R36  10K  [R0402]
R37  10K  [R0402]
R38  10K  [R0402]
R39  10K  [R0402]
R43  10K  [R0402]
R44  10K  [R0402]
R45  10K  [R0402]
R46  10K  [R0402]
U9  ESP32-S31-WROOM-3-N16R16V  [CONN-SMD_ESP32-S31-WROOM-3]
sheet MOTOR
C4  1uF  [C0402_1]
C5  1uF  [C0402_1]
C58  100nF  [C0402_1]
CN3  HX-XH2.54-2PWZ-B  [CONN-TH_2P-P2.50_HX-XH2.54-2PWZ-B]
L3  BLM18KG601SN1D  [L0603]
U11  DRV2605LDGSR  [VSSOP-10_L3.0-W3.0-P0.50-LS4.9-BL]
sheet P1
SCREW1  -  [M3螺丝]
SCREW2  -  [M3螺丝]
SCREW3  -  [M3螺丝]
SCREW4  -  [M3螺丝]
SCREW5  -  [M3螺丝]
sheet POWER
C1  10uF  [C0603_1]
C2  10uF  [C0603_1]
C3  100nF  [C0402]
C9  4.7uF  [C0603_1]
C10  10uF  [C0603_1]
C11  47nF  [C0402]
C12  10uF  [C0603_1]
C13  10uF  [C0603_1]
C14  1uF  [C0603_1]
C15  10uF  [C0603_1]
C16  47uF  [C0805]
C30  1uF  [C0402_1]
C31  1uF  [C0402_1]
C43  220nF  [C0402]
C61  220nF  [C0402]
CN2  HX-XH2.54-3PWZ-B  [CONN-TH_3P-P2.50_BX-HA2.54-3PWZ]
D2  B5817W  [SOD-123_L2.8-W1.8-LS3.7-RD]
L1  2.2uH  [IND-SMD_L2.0-W1.6]
L2  2.2uH  [IND-SMD_L2.0-W1.6]
R1  10mΩ  [R1206]
R2  1K  [R0402]
R3  22K1  [R0402]
R4  100K  [R0402]
R5  100K  [R0402]
R9  700R  [R0402]
R11  100K  [R0402]
R12  100K  [R0402]
R13  5K23  [R0402]
R14  30K1  [R0402]
R15  10K  [R0402]  (no BOM)
R16  10K  [R0402]  (no BOM)
R33  1K  [R0402]
R34  0R  [R0402]
U3  BQ25895RTW  [WQFN-24_L4.0-W4.0-P0.50-TL-EP2.7]
U4  TLV62568DBVR  [SOT-23-5_L3.0-W1.7-P0.95-LS2.8-BR]
U5  ME6211C18M5G-N  [SOT-23-5_L3.0-W1.7-P0.95-LS2.8-BR_1]
U6  GEK100  [SOT-23-6_L2.9-W1.6-P0.95-LS2.8-BL-2]
U14  STC3115AIQT  [DFN-10_L3.0-W2.0-P0.50-BL]
sheet SENSOR
C6  100nF  [C0402]
C7  100nF  [C0402]
C47  100nF  [C0402]
C48  100nF  [C0402]
C53  100nF  [C0402]
C54  1uF  [C0402]
R42  10K  [R0402]
U1  RX8130CE:BB  [RTC-SMD_L3.2-W2.5-P0.7-RX8130CE]
U15  LSM6DS3TR-C  [LGA-14_L3.0-W2.5-P0.50-TL]
sheet TOUCH_WHEEL
C59  100nF  [C0402]
FPC1  HC-FPC-05-10-12RLTAG  [FPC-SMD_12P-P0.50_HCTL_HC-FPC-05-10-12RLTAG]
sheet USB
C36  100nF  [C0402]
C37  100nF  [C0402]
C38  100nF  [C0402]
C44  100nF  [C0402]
C51  100nF  [C0402]
D1  USBLC6-2SC6  [SOT-23-6_L2.9-W1.6-P0.95-LS2.8-BL]
R21  100K  [R0402]
R22  100K  [R0402]
R31  5K1  [R0402]
R32  5K1  [R0402]
U12  CH343P  [TQFN-16_L3.0-W3.0-P0.50-BL-EP1.7]
U17  SGM7229YMS10G/TR  [MSOP-10_L3.0-W3.0-P0.50-LS4.9-BL]
USB1  TYPE-C 16PIN 2MD(073)  [USB-C-SMD_TYPE-C-16PIN-2MD-073]

## Library data of the parts
C8 C18 = CL10A226MQ8NRNC: 容值:22uF;精度:±20%;额定电压:6.3V;材质(温度系数):X5R;; LCSC Part Name: 22uF ±20% 6.3V; Supplier Part: C59461; Manufacturer: SAMSUNG(三星); Supplier Footprint: 0603; JLCPCB Part Class: 基础库; Datasheet: https://atta.szlcsc.com/upload/public/pdf/source/20160218/1457707763339.pdf; Supplier: LCSC; Tolerance: ±20%; Voltage Rated: 6.3V; Temperature Coefficient: X5R
C17 C19-C25 = CL05A225MQ5NSNC: 容值:2.2uF;精度:±20%;额定电压:6.3V;材质(温度系数):X5R;; LCSC Part Name: 2.2uF ±20% 6.3V; Supplier Part: C12530; Manufacturer: SAMSUNG(三星); Supplier Footprint: 0402; JLCPCB Part Class: 基础库; Datasheet: https://atta.szlcsc.com/upload/public/pdf/source/20160103/1457707666860.pdf; Supplier: LCSC; Tolerance: ±20%; Voltage Rated: 6.3V; Temperature Coefficient: X5R
C26 = CL05A475MP5NRNC: 容值:4.7uF;精度:±20%;额定电压:10V;材质(温度系数):X5R;; LCSC Part Name: 4.7uF ±20% 10V; Supplier Part: C23733; Manufacturer: SAMSUNG(三星); Supplier Footprint: 0402; JLCPCB Part Class: Basic Part; Datasheet: https://atta.szlcsc.com/upload/public/pdf/source/20160103/1457707710457.pdf; Supplier: LCSC; Tolerance: ±20%; Voltage Rated: 10V; Temperature Coefficient: X5R
C27-C29 = CL05B104KO5NNNC: 容值:100nF;精度:±10%;额定电压:16V;材质(温度系数):X7R;; LCSC Part Name: 100nF ±10% 16V; Supplier Part: C1525; Manufacturer: SAMSUNG(三星); Supplier Footprint: 0402; JLCPCB Part Class: Basic Part; Datasheet: https://atta.szlcsc.com/upload/public/pdf/source/20160218/1457707763339.pdf; Supplier: LCSC; Tolerance: ±10%; Voltage Rated: 16V; Temperature Coefficient: X7R
C32 C33 = CC0402JRNPO9BN100: 容值:10pF;精度:±5%;额定电压:50V;材质(温度系数):NP0;; LCSC Part Name: 10pF ±5% 50V; Supplier Part: C106199; Manufacturer: YAGEO(国巨); Supplier Footprint: 0402; JLCPCB Part Class: 扩展库; Datasheet: https://atta.szlcsc.com/upload/public/pdf/source/20170518/1495085708228.pdf; Supplier: LCSC; Tolerance: ±5%; Voltage Rated: 50V; Temperature Coefficient: NP0
C4 C5 C34 C35 C58 = CL05B104KO5NNNC: 容值:100nF;精度:±10%;额定电压:16V;材质(温度系数):X7R;; LCSC Part Name: 100nF ±10% 16V; Supplier Part: C1525; Manufacturer: SAMSUNG(三星); Supplier Footprint: 0402; JLCPCB Part Class: Basic Part; Datasheet: https://atta.szlcsc.com/upload/public/pdf/source/20160103/1457707674891.pdf; Supplier: LCSC; Tolerance: ±10%; Voltage Rated: 16V; Temperature Coefficient: X7R
CN1 = PJ-342B-TX-SMT: 连接器类型:3.5mm耳机座;额定电流:500mA;额定电压:30V;工作温度范围:-20℃~+70℃;焊接温度(最大值):235℃;; LCSC Part Name: 3.5mm耳机座 铜头镀金 四级; Supplier Part: C388632; Manufacturer: XKB Connectivity(中国星坤); Supplier Footprint: SMD; JLCPCB Part Class: 扩展库; Datasheet: https://atta.szlcsc.com/upload/public/pdf/source/20211015/23E3824CE5C565B53E4651603484B93A.pdf; Supplier: LCSC; Connector Type: 3.5mm耳机座; Current Rating (Max): 500mA; Voltage Rating (Max): 30V; Operating Temperature Range: -20℃~+70℃; Welding Temperature (Max): 235℃
R17 = 0402WGF2003TCE: 阻值:200kΩ;精度:±1%;功率:1/16W;温度系数:±100ppm/℃;最大工作电压:50V;工作温度范围:-55℃~+155℃;; LCSC Part Name: 200KΩ ±1%; Supplier Part: C25764; Manufacturer: UNI-ROYAL(厚声); Supplier Footprint: 0402; JLCPCB Part Class: Basic Part; Datasheet: https://atta.szlcsc.com/upload/public/pdf/source/20170920/C25764_1505901532268983339.pdf; Supplier: LCSC; Tolerance: ±1%; Power(Watts): 1/16W; Temperature Coefficient: ±100ppm/℃; Overload Voltage (Max): 50V; Operating Temperature Range: -55℃~+155℃
R18 R19 = 0402WGF1002TCE: 阻值:10kΩ;精度:±1%;功率:62.5mW;温度系数:±100ppm/℃;电阻类型:厚膜电阻;; LCSC Part Name: 10kΩ ±1% 62.5mW 厚膜电阻; Supplier Part: C25744; Manufacturer: UNI-ROYAL(厚声); Supplier Footprint: 0402; JLCPCB Part Class: Basic Part; Datasheet: https://atta.szlcsc.com/upload/public/pdf/source/20200306/C422600_1E6D84923E4A46A82E41ADD87F860B5C.pdf; Supplier: LCSC; Tolerance: ±1%; Power(Watts): 62.5mW; Overload Voltage (Max): 50V; Temperature Coefficient: ±100ppm/℃; Type: 厚膜电阻; Operating Temperature Range: -55℃~+155℃
U2 = CS43131-CNZ_func: 接口:I2S;分辨率:32位;电源电压:1.66V~1.94V;; Supplier: LCSC; Supplier Part: C1554759; Manufacturer: Cirrus Logic(凌云); JLCPCB Part Class: 扩展库; LCSC Part Name: CS43131 CNZ; Supplier Footprint: QFN-40-EP(5x5); Interface: I2S; Resolution: 32位; Output Type: 电压-非缓冲; Supply Voltage: 1.66V~1.94V; Operating Temperature: -10℃~+70℃
U7 = PCA9306DQER: 应用:-;隔离技术:-;; Supplier Part: C440032; Manufacturer: TI(德州仪器); Supplier Footprint: X2-SON-8(0.8x1.4); JLCPCB Part Class: 扩展库; Datasheet: https://www.ti.com/cn/lit/gpn/pca9306; Supplier: LCSC
U8 = SN74LV4T125RGYR_self: 电源电压:1.6V~5.5V;输入类型:-;灌电流(IOL):16mA;拉电流(IOH):16mA;; Supplier: LCSC; Supplier Part: C411879; Manufacturer: TI(德州仪器); JLCPCB Part Class: 扩展库; Supplier Footprint: QFN-14-EP(3.5x3.5); Datasheet: https://www.ti.com/cn/lit/gpn/sn74lv4t125; Supply Voltage: 1.6V~5.5V; output type: 三态; Sink Current: 16mA; Source Current: 16mA; Operating Temperature: -40℃~+125℃
X1 = X322526MMB4SI: 频率:26MHz;频率公差:±10ppm;负载电容:10pF;; LCSC Part Name: 26MHz ±10ppm 10pF YSX321SL; Supplier Part: C15192; Manufacturer: YXC(扬兴晶振); Supplier Footprint: SMD3225-4P; JLCPCB Part Class: 扩展库; Datasheet: https://atta.szlcsc.com/upload/public/pdf/source/20210329/C112971_1F611BDC486E193C1706F6D8EB5AA189.pdf; Supplier: LCSC; Crystal Type: 贴片无源晶振; Frequency Tolerance: ±10ppm; Frequency Stability: ±30ppm; Load Capacitance: 10pF; Operating Temperature: -40℃~+85℃
C1 C2 C9 C10 C12-C15 C42 C55-C57 = CAP_0603: Supplier Footprint: 0603
C3 C6 C7 C11 C36-C41 C43-C48 C51 C53 C54 C59 C61 = CAP_0402: Supplier Footprint: 0402
FPC2 = AFE03-S21FMA-1H: 锁定特性:翻盖式;触点类型:下接;触点数量:21P;间距:0.3mm;安装方式:卧贴;; LCSC Part Name: 翻盖式 下接 P数:21P 间距:0.3mm; Supplier Part: C262542; Manufacturer: JS(钜硕电子); Supplier Footprint: SMD,P=0.3mm,卧贴; JLCPCB Part Class: Extended Part; Datasheet: https://item.szlcsc.com/datasheet/AFE03-S21FMA-1H/253851.html; Supplier: LCSC; Locking Feature: 翻盖式; Contact Type: 下接; Number of Contacts: 21P; Pitch: 0.3mm; Mounting Type: 卧贴; FFC, FCB Thickness: 0.2mm; Height Above Board: 1mm; Contact Material: 铜合金; Contact Plating: 锡; FPC/FFC Lock: 不带扣; Forward Foot / Back Foot: 正脚
L1 L2 L4 = WPN201610M2R2MT: 电感值:2.2uH;精度:±20%;额定电流:1.6A;饱和电流(Isat):2A;类型:-;; LCSC Part Name: 2.2uH ±20% 2A; Supplier Part: C97011; Manufacturer: Sunlord(顺络); Supplier Footprint: 0806; JLCPCB Part Class: Extended Part; Datasheet: https://item.szlcsc.com/datasheet/WPN201610M2R2MT/98216.html; Supplier: LCSC; Tolerance: ±20%; Current Rating: 1.6A; Current - Saturation(Isat): 2A; DC Resistance(DCR): 135mΩ
R40 = Res_1206: Supplier Footprint: 1206
R2-R9 R11-R16 R20-R39 R41-R46 = Res_0402: Supplier Footprint: 0402
U16 = PAM2804AAB010: 类型:DC-DC;工作电压(DC):2.5V~6V;开关频率:1.5MHz;通道数:1;输出电压:-;输出电流:1A;调光:PWM;拓扑结构:降压;; LCSC Part Name: 输出1A 降压型驱动; Supplier Part: C71463; Manufacturer: DIODES(美台); Supplier Footprint: TSOT-25; JLCPCB Part Class: Extended Part; Datasheet: https://item.szlcsc.com/datasheet/PAM2804AAB010/72571.html; Supplier: LCSC; Type: DC-DC; Voltage - Input(DC): 2.5V~6V; Frequency - Switching: 1.5MHz; Number of Channels: 1; Output Current: 1A; Dimming: PWM; Features: 内置软启动；LED开路保护；过温保护(OTP)；短路保护(SCP); Topology: 降压; Operating temperature: -40℃~+125℃; Switch Tube (Built-In/External): 内置
C49 C50 C52 C60 = HGC0402R5106M100NTEJ: 容值:10uF;精度:±20%;额定电压:10V;温度系数:X5R;; LCSC Part Name: 10uF ±20% 10V; Supplier Part: C7472949; Manufacturer: Chinocera(华瓷); Supplier Footprint: 0402; JLCPCB Part Class: Extended Part; Datasheet: https://item.szlcsc.com/datasheet/HGC0402R5106M100NTEJ/8532796.html; Supplier: LCSC; Tolerance: ±20%; Voltage Rating: 10V; Temperature Coefficient: X5R
CARD2 = TF PUSH: 卡连接方式:自弹式;卡类型:MicroSD卡(TF卡);连接器类型:卡座;本体最大高度:2mm;工作温度:-25℃~+90℃;; LCSC Part Name: 9P，自弹式TF卡座; Supplier Part: C393941; Manufacturer: SHOU HAN(首韩); Supplier Footprint: SMD; JLCPCB Part Class: Extended Part; Datasheet: https://item.szlcsc.com/datasheet/TF%2520PUSH/372553.html; Supplier: LCSC; Card Connection Mode: 自弹式; Card Type: MicroSD卡(TF卡); Connector Type: 卡座; Additional Card Detection Pins: 无; Height Above Board: 2mm; Operating Temperature: -25℃~+90℃
U10 = W25Q128JVSIQ: 接口类型:SPI;存储容量:128Mbit;时钟频率(fc):133MHz;; LCSC Part Name: 编带 支持双路/四路SPI接口的3V、128Mbit 串行闪存; Supplier Part: C97521; Manufacturer: Winbond(华邦); Supplier Footprint: SOIC-8-208mil; JLCPCB Part Class: Basic Part; Datasheet: https://item.szlcsc.com/datasheet/W25Q128JVSIQ/98729.html; Supplier: LCSC; Interface: SPI; Memory Size: 128Mbit; Clock Frequency: 133MHz; Voltage - Supply: 2.7V~3.6V; Standby Supply Current: 1uA; Program / Erase Cycles: 100000次; Page Programming Time (Tpp): 3ms; Block Erase Time(tBE): 120ms@(32KB); Data Retention - TDR (Year): 20年; Operating Temperature: -40℃~+85℃
Q1 Q2 = S8050_SOT_NPN: Supplier Footprint: SOT-23
U9 = ESP32-S31-WROOM-3-N16R16V_C55371223: Supplier Part: C55371223; Manufacturer: ESPRESSIF(乐鑫); JLCPCB Part Class: Extended Part; Datasheet: https://item.szlcsc.com/datasheet/ESP32-S31-WROOM-3-N16R16V/59318919.html; Supplier: LCSC
CN3 = HX-XH2.54-2PWZ-B: 插针结构:1x2P;间距:2.54mm;安装方式:弯插;参考系列:XH;总PIN数:2P;排数:1;每排PIN数:2;行距:-;额定电流:3A;触头材质:黄铜;触头镀层:锡;工作温度:-25℃~+85℃;; LCSC Part Name: 1x2P 间距:2.54mm 弯插 系列:XH; Supplier Part: C49010023; Manufacturer: hanxia(韩下); Supplier Footprint: 弯插,P=2.5mm; JLCPCB Part Class: Extended Part; Datasheet: https://item.szlcsc.com/datasheet/HX-XH2.54-2PWZ-B/51365944.html; Supplier: LCSC; Pins Structure: 1x2P; Pitch: 2.54mm; Mounting Type: 弯插; Reference Series: XH; Number of Pins: 2P; Number of Rows: 1; Number of PINs Per Row: 2; Current Rating: 3A; Contact Material: 黄铜; Contact Plating: 锡; Operating Temperature: -25℃~+85℃; Voltage Rating: 250V; Plastic Material: PA66; Flame Retardant Rating: UL94V-0; Color: 黑色
L3 = BLM18KG601SN1D: 阻抗@频率:600Ω@100MHz;误差:±25%;直流电阻(DCR):150mΩ;; LCSC Part Name: 单路 0603磁珠 阻抗600Ω@100MHz; Supplier Part: C85833; Manufacturer: muRata(村田); Supplier Footprint: 0603; JLCPCB Part Class: Extended Part; Datasheet: https://item.szlcsc.com/datasheet/BLM18KG601SN1D/87009.html; Supplier: LCSC; Impedance @ Frequency: 600Ω@100MHz; Tolerance: ±25%; DC Resistance(DCR): 150mΩ; Current Rating: 1.3A; Number of Circuits: 1; Operating Temperature: -55℃~+125℃
U11 = DRV2605LDGSR: DRV2605L 具有 2V 工作电压、波形库和自动谐振跟踪功能的 ERM/LRA 触觉驱动器; LCSC Part Name: 5.5V电机驱动芯片; Supplier Part: C527464; Manufacturer: TI(德州仪器); Supplier Footprint: VSSOP-10-0.5mm; JLCPCB Part Class: Extended Part; Datasheet: https://www.ti.com/cn/lit/ds/symlink/drv2605l.pdf; Supplier: LCSC; Technology: 是; Number of H-bridges: 1; Voltage - Supply: 2V~5.2V; Interface: I2C; Quiescent Current(Iq): 500uA; Operating Temperature: -40℃~+85℃; Features: 软开关；主动制动功能
SCREW1-SCREW5 = M3螺丝: Supplier Footprint: 插件
C16 = CAP_0805: Supplier Footprint: 0805
C30 C31 = CL05A105KA5NQNC: 容值:1uF;精度:±10%;额定电压:25V;材质(温度系数):X5R;; LCSC Part Name: 1uF ±10% 25V; Supplier Part: C52923; Manufacturer: SAMSUNG(三星); Supplier Footprint: 0402; JLCPCB Part Class: Basic Part; Datasheet: https://atta.szlcsc.com/upload/public/pdf/source/20160103/1457707735223.pdf; Supplier: LCSC; Tolerance: ±10%; Voltage Rated: 25V; Temperature Coefficient: X5R
CN2 = HX-XH2.54-3PWZ-B: 插针结构:1x3P;间距:2.54mm;安装方式:弯插;参考系列:XH;总PIN数:3P;排数:1;每排PIN数:3;行距:-;额定电流:3A;触头材质:黄铜;触头镀层:锡;工作温度:-25℃~+85℃;; LCSC Part Name: 1x3P 间距:2.54mm 弯插 系列:XH; Supplier Part: C49010024; Manufacturer: hanxia(韩下); Supplier Footprint: 弯插,P=2.5mm; JLCPCB Part Class: Extended Part; Datasheet: https://item.szlcsc.com/datasheet/HX-XH2.54-3PWZ-B/51365945.html; Supplier: LCSC; Pins Structure: 1x3P; Pitch: 2.54mm; Mounting Type: 弯插; Reference Series: XH; Number of Pins: 3P; Number of Rows: 1; Number of PINs Per Row: 3; Current Rating: 3A; Contact Material: 黄铜; Contact Plating: 锡; Operating Temperature: -25℃~+85℃; Voltage Rating: 250V; Plastic Material: PA66; Flame Retardant Rating: UL94V-0; Color: 黑色
D2 = B5817W: 正向压降(Vf):450mV@1A;直流反向耐压(Vr):20V;整流电流:300mA;; LCSC Part Name: 电压:20V 电流:300mA; Supplier Part: C181205; Manufacturer: Hottech(合科泰); Supplier Footprint: SOD-123; JLCPCB Part Class: Extended Part; Datasheet: https://atta.szlcsc.com/upload/public/pdf/source/20220428/C1DD5752BAF858845B9886607C426C4B.pdf; Supplier: LCSC; Forward Voltage (Vf@If): 450mV@1A; Reverse Voltage (Vr): 20V; Rectified Current: 300mA
R1 = RE1206F1R010: 电阻类型:采样电阻；合金电阻;阻值:10mΩ;精度:±1%;功率:1W;温度系数:±50ppm/℃;安装方式:贴片;; LCSC Part Name: 10mΩ 1W 1206 ±1%; Supplier Part: C46961737; Manufacturer: JIERR(捷而瑞); Supplier Footprint: 1206; JLCPCB Part Class: Extended Part; Datasheet: https://item.szlcsc.com/datasheet/RE1206F1R010/49133276.html; Supplier: LCSC; Type: 采样电阻；合金电阻; Tolerance: ±1%; Power(Watts): 1W; Temperature Coefficient: ±50ppm/℃; Mounting Type: 贴片
U3 = DSCB_BQ25895RTW
U4 = TLV62568DBVR: 功能类型:降压型;工作电压:2.5V~5.5V;输出电压:600mV~5.5V;输出电流:1A;输出类型:可调;; LCSC Part Name: 降压型 1A 2.5V~5.5V; Supplier Part: C163219; Manufacturer: TI(德州仪器); Supplier Footprint: SOT-23-5; JLCPCB Part Class: Extended Part; Datasheet: https://www.ti.com/cn/lit/ds/symlink/tlv62568.pdf; Supplier: LCSC; Function: 降压型; Voltage - Supply: 2.5V~5.5V; Output Voltage: 600mV~5.5V; Output Current: 1A; Frequency - Switching: 1.5MHz; Operating Temperature: -40℃~+125℃@(TJ); Synchronous Rectifier: 是; Number of Outputs: 1; Topology: 降压式; Quiescent Current: 35uA; Switch tube (built-in/external): 内置; Output Type: 可调; Features: 轻载高效模式；过流保护；工作状态指示
U5 = ME6211C18M5G-N: 输出类型:固定;输出极性:正;最大输入电压:6.5V;输出电压:1.8V;输出电流:300mA;电源纹波抑制比(PSRR):70dB@(1kHz);; LCSC Part Name: 输入6.5V 输出1.8V~1.8V 300mA; Supplier Part: C236671; Manufacturer: MICRONE(南京微盟); Supplier Footprint: SOT-23-5; JLCPCB Part Class: 扩展库; Datasheet: https://atta.szlcsc.com/upload/public/pdf/source/20180801/C94042_8FDAFF138ADDED65E3D077205E9A8C17.pdf; Supplier: LCSC; Output Type: 固定; Output Polarity: 正; Number of Outputs: 1; Maximum Input Voltage: 6.5V; Output Voltage: 1.8V; Dropout Voltage: 400mV@(200mA); Output Current: 300mA; Power Supply Rejection Ratio (PSRR): 70dB@(1kHz)
U6 = GEK100: Supplier Part: C9900253815; Supplier Footprint: SOT23-6L; Supplier: LCSC
U14 = STC3115AIQT: 工作电压:2.7V~4.5V;最大充电电流:-;电池类型:锂电池;电池节数:1;; LCSC Part Name: 用于手持应用的带报警输出的电量计IC; Supplier Part: C2688637; Manufacturer: ST(意法半导体); Supplier Footprint: DFN-10(2x3); JLCPCB Part Class: Extended Part; Datasheet: https://item.szlcsc.com/datasheet/STC3115AIQT/2794432.html; Supplier: LCSC; The Chip Type: 监测芯片; Voltage - Supply: 2.7V~4.5V; Type of Battery: 锂电池; Number of Cells: 1; Operating Temperature: -40℃~+85℃; Battery Temperature Detection: 不支持; Supply Current (Iq): 2uA; Interface: I2C; Features: 欠压锁定
U1 = RX8130CE:BB: 接口类型:I2C;晶振类型:内置;闹钟输出:有;; LCSC Part Name: 实时时钟模块（I2C总线）内置备份电池充电控制功能; Supplier Part: C1542426; Manufacturer: EPSON(爱普生); Supplier Footprint: SMD-10P; JLCPCB Part Class: Extended Part; Datasheet: https://item.szlcsc.com/datasheet/RX8130CE%253ABB/1633229.html; Supplier: LCSC; Interface: I2C; crystal oscillator: 内置; Alarm Output: 有; Current - Supply: 3.5uA; Voltage - Supply: 1.25V~5.5V; Quiescent Current(Iq): 300nA; Operating Temperature: -40℃~+85℃; Features: 备份电源管理与电池充电；睡眠/唤醒控制；告警功能；周期性中断输出；可编程时钟输出
U15 = LSM6DS3TR-C: 传感器类型:IMU(加速度计+陀螺仪);接口类型:I2C；SPI;; LCSC Part Name: IMU-惯性测量单元; Supplier Part: C967633; Manufacturer: ST(意法半导体); Supplier Footprint: LGA-14(2.5x3); JLCPCB Part Class: Extended Part; Datasheet: https://item.szlcsc.com/datasheet/LSM6DS3TR-C/1054343.html; Supplier: LCSC; Accelerometer Sensing Axis: X,Y,Z; Acceleration Measurement Range (MAX): ±16g; Gyroscope Sensing Axis: X,Y,Z; Gyroscope Measurement Range (MAX): ±2000dps; Sensor Type: IMU(加速度计+陀螺仪); Output Bits: 16bit; Interface: I2C；SPI; Voltage - Supply: 1.71V~3.6V; Cache Size: 4KB; Standby Current: 3uA; Operating Temperature: -40℃~+85℃; Features: 运动事件检测；同步与时间戳
FPC1 = HC-FPC-05-10-12RLTAG: 锁定特性:翻盖式;触点类型:下接;触点数量:12P;间距:0.5mm;安装方式:卧贴;工作温度:-55℃~+85℃;; LCSC Part Name: 翻盖式 下接 P数:12P 间距:0.5mm; Supplier Part: C5213732; Manufacturer: HCTL(华灿天禄); Supplier Footprint: SMD,P=0.5mm,卧贴; JLCPCB Part Class: Extended Part; Datasheet: https://item.szlcsc.com/datasheet/HC-FPC-05-10-12RLTAG/5909024.html; Supplier: LCSC; Locking Feature: 翻盖式; Contact Type: 下接; Number of Contacts: 12P; Pitch: 0.5mm; Mounting Type: 卧贴; FFC, FCB Thickness: 0.3mm; Height Above Board: 1mm; Contact Material: 铜合金; Operating Temperature: -55℃~+85℃; Rated Voltage (Max): 50V; Current Rating (Max): 400mA; FPC/FFC Lock: 不带扣; Forward Foot / Back Foot: 无正反区分
D1 = USBLC6-2SC6: 最大钳位电压:15V;击穿电压:6V;; Supplier Part: C2687116; Manufacturer: UMW(友台半导体); Supplier Footprint: SOT-23-6; JLCPCB Part Class: Extended Part; Datasheet: https://atta.szlcsc.com/upload/public/pdf/source/20231109/512642D850D9873E7C519F71E85B9A10.pdf; Supplier: LCSC; Maximum Clamping Voltage: 15V; Breakdown Voltage: 6V; Number of Lines: 双路; Type: ESD
U12 = CH343P: 应用功能:USB转UART;USB协议版本:USB 2.0;通道数:-;数据速率:6Mbps;; LCSC Part Name: USB转高速串口芯片; Supplier Part: C2846043; Manufacturer: WCH(南京沁恒); Supplier Footprint: TQFN-16-EP(3x3); JLCPCB Part Class: Extended Part; Datasheet: https://item.szlcsc.com/datasheet/CH343P/3039795.html; Supplier: LCSC; Applications Function: USB转UART; USB Protocol: USB 2.0; Voltage - Supply: 3.3V；5V; Data Rate: 6Mbps; Operating Temperature: -40℃~+85℃; Current - Supply: 3mA; Quiescent Supply Current: 90uA; Features: 可编程波特率；唤醒功能；内置时钟发生器；硬件流控支持；低功耗模式；上电复位
U17 = SGM7229YMS10G/TR_C5153175: 开关电路:2:1;通道数:-;导通电阻(Ron):6Ω;; Supplier Part: C5153175; Manufacturer: SGMICRO(圣邦微); Supplier Footprint: MSOP-10; JLCPCB Part Class: Extended Part; Datasheet: https://item.szlcsc.com/datasheet/SGM7229YMS10G%252FTR/5779903.html; Supplier: LCSC; Switch Circuit: 2:1; Ron: 6Ω; Voltage - Supply: 1.8V~5.5V; Con: 8pF; Turn-on time: 30ns; Turn-off time: 18ns; Bandwidth: 850MHz; Operating Temperature: -40℃~+85℃; Propagation Delay (tpd): 500ps; Features: 双向模拟通道；断电隔离；故障保护
USB1 = TYPE-C 16PIN 2MD(073): 连接器类型:Type-C;协议标准:-;公母:母;安装方式:卧贴;触点数量:16P;端口数量:1;额定电流 - 电源:3A;工作温度:-25℃~+85℃;; LCSC Part Name: Type-C 母 卧贴; Supplier Part: C2765186; Manufacturer: SHOU HAN(首韩); Supplier Footprint: SMD; JLCPCB Part Class: Extended Part; Datasheet: https://item.szlcsc.com/datasheet/TYPE-C%252016PIN%25202MD(073)/2901843.html; Supplier: LCSC; Connector Type: Type-C; Gender: 母; Mounting Type: 卧贴; Number of Contacts: 16P; Number of Ports: 1; Current Rating-Power: 3A; Voltage Rating: 5V; Connect-Disconnect Life: 1万次; Detection color: 黑色; Operating Temperature: -25℃~+85℃

## Nets
GND: C1.1 C2.1 C3.1 C4.1 C5.1 C6.2 C7.2 C9.2 C10.1 C12.1 C13.1 C14.1 C15.1 C16.2 C17.2 C19.2 C21.2 C22.2 C23.1 C26.2 C27.2 C28.2 C29.2 C30.1 C31.1 C32.1 C33.2 C34.2 C35.1 C36.2 C37.2 C38.2 C39.2 C40.2 C41.2 C42.1 C43.2 C44.2 C45.2 C46.2 C47.2 C48.2 C49.1 C50.1 C51.2 C52.1 C53.2 C54.2 C55.1 C56.1 C57.1 C58.1 C59.2 C60.1 C61.2 CARD2.6(VSS) CARD2.10(EP) CARD2.11(EP) CARD2.12(EP) CARD2.13(EP) CN1.2 CN1.5 D1.2(GND) FPC1.1 FPC1.12 FPC1.13 FPC1.14 FPC2.12 FPC2.17 R1.2 R3.1 R5.1 R9.1 R11.1 R12.1 R14.1 R16.1 R21.1 R22.2 R31.1 R32.1 R40.1 R41.1 R44.1 U1.7(GND) U2.8(GNDA) U2.13(HPREFA) U2.17(HPREFB) U2.19(GNDCP) U2.30(ADR) U2.35(GNDD) U2.41(EP) U3.17(PGND) U3.18(PGND) U3.25(PGND) U4.2(GND) U5.2(VSS) U6.2(GND) U7.1(GND) U8.1(1OE#) U8.4(2OE#) U8.7(GND) U8.10(3OE#) U8.13(4OE#) U8.15(GND) U9.1(GND) U9.2(GND) U9.26(GND) U9.47(GND) U9.48(GND) U9.72(GND) U9.73(GND) U9.74(GND) U9.75(GND) U9.76(GND) U9.77(GND) U9.78(GND) U9.79(GND) U9.80(GND) U9.81(GND) U9.82(GND) U9.83(GND) U9.84(GND) U9.85(GND) U9.86(GND) U9.87(GND) U9.88(GND) U9.89(GND) U9.90(GND) U9.92(GND) U9.93(GND) U9.94(GND) U9.95(GND) U9.96(GND) U9.97(GND) U9.98(GND) U9.99(GND) U10.4(GND) U11.4(IN/TRIG) U11.8(GND) U12.2(GND) U12.17(EP) U14.5(GND) U15.2(SDx) U15.3(SCx) U15.6(GND) U15.7(GND) U16.2(GND) U17.5(GND) USB1.13(EH) USB1.14(EH) USB1.A1B12(GND) USB1.B1A12(GND) X1.2(GND) X1.4(GND)
VBAT: C7.1 C10.2 C43.1 CN2.1 R2.2 U1.10(VBAT) U3.13(BAT) U3.14(BAT) U14.9(VCC)
VBUS_5V: C14.2 C36.1 C44.1 C51.1 D1.5(VBUS) U3.1(VBUS) U12.3(VDD5) U12.9(VBUS) U17.1(VCC) USB1.A4B9(VBUS) USB1.B4A9(VBUS)
VCC: C1.2 C3.2 C12.2 C13.2 C15.2 C26.1 C29.1 C30.2 L2.2 U2.26(VP) U3.15(SYS) U3.16(SYS) U4.4(VIN) U5.1(VIN) U5.3(CE) U6.6(VDD)
VCC_1V8: C8.2 C17.1 C23.2 C27.1 C28.1 C31.2 C34.1 C35.2 R18.2 R19.2 U2.4(VD) U2.7(VA) U2.25(VCP) U2.31(VL) U5.5(VOUT) U7.2(VREF1) U8.14(VCC)
VCC_3V3: C2.2 C6.1 C37.1 C40.1 C41.1 C45.1 C46.1 C47.1 C48.1 C49.2 C50.2 C52.2 C53.1 C59.1 C60.2 CARD2.4(VDD) FPC1.2 FPC2.13 FPC2.14 L1.2 R4.2 R6.2 R7.1 R8.1 R17.2 R20.1 R25.1 R26.1 R29.2 R30.1 R35.1 R36.1 R37.1 R38.1 R39.1 R42.2 R43.1 R45.1 R46.1 U1.1(Vio) U1.8(VDD) U9.3(3V3) U9.4(3V3) U10.8(VCC) U12.1(VIO) U15.1(SDO/SA0) U15.5(VDDIO) U15.8(VDD) U15.12(CS)
VCC_LCD_BG: C16.1 C56.2 C57.2 D2.1(C) L3.2 U3.23(PMID) U16.4(VIN)
BAT_TS: CN2.2 R13.2 R14.2 R15.2 R16.2 U3.11(TS)
BQ25895_CHG_EN#: R11.2 U3.9(~{CE})
BQ25895_DSEL: U3.24(DSEL)
BQ25895_I2C_CLK: FPC1.4 R7.2 U1.2(SCL) U3.5(SCL) U9.45(IO36) U11.2(SCL) U14.3(SCL)
BQ25895_I2C_SDA: FPC1.3 R8.2 U1.3(SDA) U3.6(SDA) U9.46(IO37) U11.3(SDA) U14.2(SDA)
BQ25895_INT: R43.2 U3.7(INT) U9.49(IO38)
BQ25895_OTG_EN: R12.2 U3.8(OTG) U9.50(IO39)
BQ25895_QON#: U3.12(~{QON})
BQ25895_STAT: U3.4(STAT)
BQ25895_USB_DN: U3.3(D-)
BQ25895_USB_DP: U3.2(D+)
CH343P_UART_DTR: Q2.2 R23.1 R28.2 U12.12(DTRTNOW)
CH343P_UART_RTS: Q1.2 R24.1 R27.1 U12.13(RTS)
CH343P_UART_RX: U9.68(TX0) U12.5(RXD)
CH343P_UART_TX: U9.69(RX0) U12.4(TXD)
CH343P_USB_DN: U12.8(UD-) U17.8(HSD2-)
CH343P_USB_DP: U12.7(UD+) U17.9(HSD2+)
CS43131_I2S_LRCK: U2.38(LRCK1) U8.6(2Y)
CS43131_I2S_SCLK: U2.34(SCLK1) U8.8(3Y)
CS43131_I2S_SDIN: U2.2(SDIN1) U8.3(1Y)
CS43131_RST#_1V8: U2.28(RESET#) U8.11(4Y)
CS43131_SCL_1V8: R18.1 U2.39(SDA) U7.3(SCL1)
CS43131_SDA_1V8: R19.1 U2.1(SCL) U7.4(SDA1)
DAC_I2C_SCL: R26.2 U7.6(SCL2) U9.12(IO6) U15.13(SCL)
DAC_I2C_SDA: R30.2 U7.5(SDA2) U9.13(IO7) U15.14(SDA)
DAC_I2S_LRCK: U8.5(2A) U9.21(IO15)
DAC_I2S_SCLK: U8.9(3A) U9.24(IO18)
DAC_I2S_SDIN: U8.2(1A) U9.22(IO16)
DAC_RST#: U8.12(4A) U9.23(IO17)
ESP32S31_BOOT: Q2.3
ESP32S31_EN: C39.1 Q1.3 R27.2 R29.1 U9.5(EN)
ESP_BOOT1: R20.2 R28.1 U9.71(IO61)
ESP_BOOT2: R25.2 U9.70(IO60)
ESP_FLASH_CLK: U9.17(IO11) U10.6(CLK)
ESP_FLASH_CS: R6.1 U9.14(IO8) U10.1(CS#)
ESP_FLASH_DI: U9.18(IO12) U10.5(DI)
ESP_FLASH_DO: U9.15(IO9) U10.2(DO)
ESP_FLASH_HOLD: U9.16(IO10) U10.7(IO3)
ESP_FLASH_WP: U9.19(IO13) U10.3(IO2)
ESP_I2C2_SCL: FPC2.19 R45.2 U9.66(IO56)
ESP_I2C2_SDA: FPC2.20 R46.2 U9.65(IO55)
ESP_IO1: U9.9(IO1) U15.9(INT2)
ESP_IO4: U9.10(IO4) U15.4(INT1)
ESP_IO5: U9.11(IO5)
ESP_IO19: CARD2.CD U9.25(IO19)
ESP_IO34: R22.1 U9.43(IO34) U17.2(S)
ESP_IO35: R42.1 U1.6(#IRQ) U9.44(IO35)
ESP_IO40: R44.2 U9.51(IO40) U11.5(EN)
ESP_IO42: FPC1.11 U6.1(KEY) U9.52(IO42)
ESP_IO43: FPC1.5 U9.53(IO43)
ESP_IO44: FPC1.6 U9.54(IO44)
ESP_IO45: R41.2 U9.55(IO45) U16.1(EN)
ESP_IO46: FPC2.4 U9.56(IO46)
ESP_IO47: FPC2.3 U9.57(IO47)
ESP_IO54: FPC2.18 U9.64(IO54)
ESP_IO57: FPC2.21 U9.67(IO57)
ESP_SPI2_CLK: FPC2.5 U9.58(IO48)
ESP_SPI2_CS: FPC2.7 U9.59(IO49)
ESP_SPI2_D0: FPC2.11 U9.63(IO53)
ESP_SPI2_D1: FPC2.10 U9.61(IO51)
ESP_SPI2_D2: FPC2.9 U9.62(IO52)
ESP_SPI2_D3: FPC2.8 U9.60(IO50)
ESP_TF_CLK: CARD2.5(CLX) U9.31(SD_CLK)
ESP_TF_CMD: CARD2.3(CMD) R39.2 U9.32(SD_CMD)
ESP_TF_DAT0: CARD2.7(DAT0) R38.2 U9.27(SD_D0)
ESP_TF_DAT1: CARD2.8(DAT1) R35.2 U9.28(SD_D1)
ESP_TF_DAT2: CARD2.1(DAT2) R36.2 U9.29(SD_D2)
ESP_TF_DAT3: CARD2.2(CD/DAT3) R37.2 U9.30(SD_D3)
ESP_USB_DN: U9.41(USB_DM) U17.6(HSD1-)
ESP_USB_DP: U9.40(USB_DP) U17.7(HSD1+)
GBAT: CN2.3 R1.1 R34.1 U14.6(CG)
GEK100_RST: U6.3(RST)
LCD_LEDA: C42.2 C55.2 FPC2.1 L4.2
LCD_LEDK: FPC2.2 R40.2 U16.5(FB)
MOTOR_OUT_N: CN3.2 U11.9(OUT-)
MOTOR_OUT_P: CN3.1 U11.7(OUT+)
PWR_3V3_EN: R5.2 U4.1(EN) U6.5(OUTH)
SGM7227_EN#: R21.2 U17.10(OE#)
STC3115_ALM: U14.1(ALM)
TYPEC_USB_DN: D1.4(I/O2) U17.4(D-)
TYPEC_USB_DN_IN: D1.3(I/O2) USB1.A7(Dn1) USB1.B7(Dn2)
TYPEC_USB_DP: D1.6(I/O1) U17.3(D+)
TYPEC_USB_DP_IN: D1.1(I/O1) USB1.A6(Dp1) USB1.B6(Dp2)
$2N13: C11.1 U3.21(BTST)
$2N14: C11.2 D2.2(A) L2.1 U3.19(SW) U3.20(SW)
$2N19: R9.2 U3.10(ILIM)
$2N84: L1.1 U4.3(SW)
$2N86: R3.2 R4.1 U4.5(FB)
$2N133: R33.1 U14.8(BATD/CD)
$2N135: R33.2 R34.2
$2N157: C61.1 R2.1 U14.10(VIN)
$3N1: C32.2 U2.36(XTO) X1.1(OSC1)
$3N2: C33.1 U2.37(XTI/MCLK) X1.3(OSC2)
$3N20: C18.2 C19.1 U2.9(–VA)
$3N22: C24.2 C25.2 U2.23(FLYC_VCP)
$3N23: C25.1 U2.20(FLYN_VCP)
$3N24: C24.1 U2.24(FLYP_VCP)
$3N25: C22.1 U2.18(VCP_FILT–)
$3N26: C21.1 U2.21(VCP_FILT+)
$3N29: C20.1 U2.10(FLYP_VA)
$3N30: C20.2 U2.11(FLYN_VA)
$3N32: C18.1 U2.6(FILT-)
$3N34: C8.1 U2.5(FILT+)
$3N63: R17.1 U7.7(VREF2) U7.8(EN)
$3N69: CN1.3 U2.14(HPOUTA)
$3N70: CN1.6 U2.16(HPOUTB)
$4N41: L4.1 U16.3(SW)
$5N6: C4.2 U11.1(REG)
$5N15: C5.2 C58.2 L3.1 U11.6(VDD/NC) U11.10(VDD)
$6N45: R32.2 USB1.B5(CC2)
$6N46: R31.2 USB1.A5(CC1)
$6N67: C38.1 U12.6(V3)
$7N55: C54.1 U1.9(VOUT)
Net-(C9-1): C9.1 R13.1 R15.1 U3.22(REGN)
Net-(Q1-1): Q1.1 R23.2
Net-(Q2-1): Q2.1 R24.2

Not connected (* = marked no-connect by the designer): CN1 4* 7*; FPC1 7* 8* 9* 10*; FPC2 6* 15* 16* 22 23; SCREW1 1; SCREW2 1; SCREW3 1; SCREW4 1; SCREW5 1; U1 4(FOUT)* 5(#RST)*; U2 3(TSO)* 12(HPINA)* 15(HPINB)* 22(HP_DETECT)* 27(INT#)* 29(DSDB/LRCK2)* 32(DSDCLK/SCLK2)* 33(CLKOUT)* 40(DSDA/SDIN2)*; U5 4(NC)*; U6 4(OUTL)*; U9 6(IO2) 7(IO3) 8(IO0) 20(IO14) 33(NC)* 34(NC)* 35(NC)* 36(NC)* 37(NC)* 38(NC)* 39(NC)* 42(IO33) 91(NC); U12 10(ACT#)* 11(DCD)* 14(DSR)* 15(CTS)* 16(RI)*; U14 4(NC)* 7(RSTIO)*; U15 10(NC)* 11(NC)*; USB1 A8(SBU1)* B8(SBU2)*

## Notes on the sheets
sheet 2
- 3.1-A Boost Mode Output
- GEK100-57(5S开机7秒关机)SOT23-6
- 关机0功耗，默认上电关机
sheet 6
- Default Use USB1 Connect SOC
sheet 8
- NC
sheet 9
- ESP32S31
- FLASH/SDCARD
- AUDIO DAC
